# Altium project CSB540otn.PrjPcb (part 1 of 2)
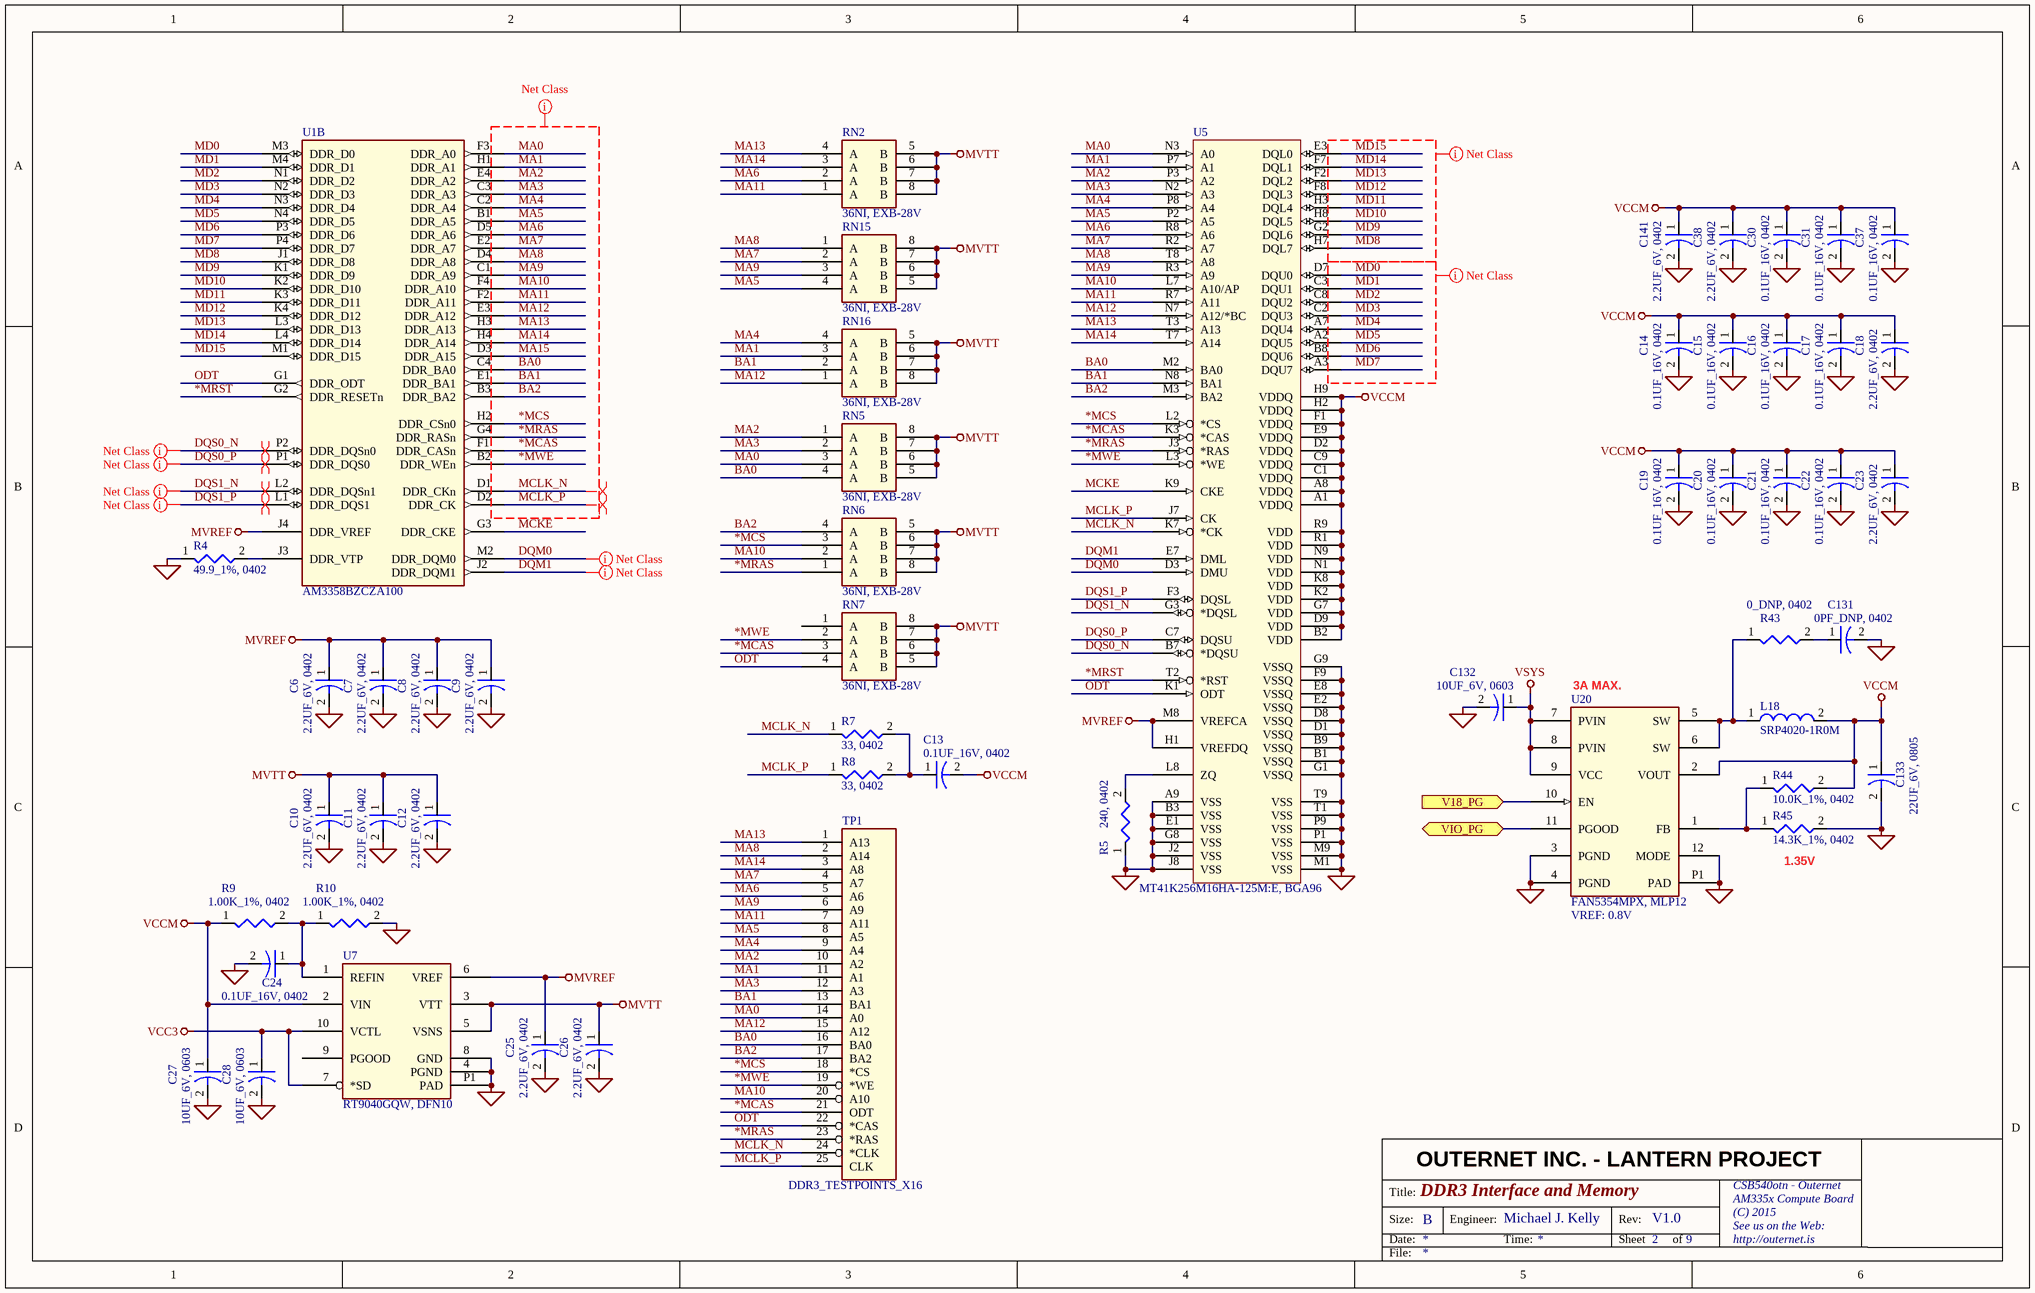
[diagram p0: ddr3_if.SchDoc]
9 sheets, 336 parts. Net scope: flat (ports and power ports of the same name join across sheets).
Board file: CSB540otn.PcbDoc
Sheets:
  rev_notes.SchDoc
  ddr3_if.SchDoc
  cpu_nand.SchDoc
  cpu_io.SchDoc
  enet_phy.SchDoc
  rf_mods.SchDoc
  io_conn.SchDoc
  cpu_pwr.SchDoc
  bat_ctl.SchDoc

## Sheet rev_notes.SchDoc: Revision Notes
size B; Engineer: Michael J. Kelly; Organization: CSB540otn - Outernet; Address1: AM335x Compute Board; Address2: (C) 2015; Address3: See us on the Web:; Address4: http://outernet.is; DocumentNumber: 1; Revision: V1.0; SheetNumber: 1; SheetTotal: 9

### Notes on the sheet
- OUTERNET INC. - LANTERN PROJECT
- Title:
- Size:
- Date:
- B
- Engineer:
- Time:
- Rev:
- Sheet
- of
- File:

## Sheet ddr3_if.SchDoc: DDR3 Interface and Memory
size B; Engineer: Michael J. Kelly; Organization: CSB540otn - Outernet; Address1: AM335x Compute Board; Address2: (C) 2015; Address3: See us on the Web:; Address4: http://outernet.is; DocumentNumber: 2; Revision: V1.0; SheetNumber: 2; SheetTotal: 9

### Parts
C6  2.2UF_6V, 0402  [0402C]
C7  2.2UF_6V, 0402  [0402C]
C8  2.2UF_6V, 0402  [0402C]
C9  2.2UF_6V, 0402  [0402C]
C10  2.2UF_6V, 0402  [0402C]
C11  2.2UF_6V, 0402  [0402C]
C12  2.2UF_6V, 0402  [0402C]
C13  0.1UF_16V, 0402  [0402C]
C14  0.1UF_16V, 0402  [0402C]
C15  0.1UF_16V, 0402  [0402C]
C16  0.1UF_16V, 0402  [0402C]
C17  0.1UF_16V, 0402  [0402C]
C18  2.2UF_6V, 0402  [0402C]
C19  0.1UF_16V, 0402  [0402C]
C20  0.1UF_16V, 0402  [0402C]
C21  0.1UF_16V, 0402  [0402C]
C22  0.1UF_16V, 0402  [0402C]
C23  2.2UF_6V, 0402  [0402C]
C24  0.1UF_16V, 0402  [0402C]
C25  2.2UF_6V, 0402  [0402C]
C26  2.2UF_6V, 0402  [0402C]
C27  10UF_6V, 0603  [0603C]
C28  10UF_6V, 0603  [0603C]
C30  0.1UF_16V, 0402  [0402C]
C31  0.1UF_16V, 0402  [0402C]
C37  0.1UF_16V, 0402  [0402C]
C38  2.2UF_6V, 0402  [0402C]
C131  0PF_DNP, 0402  [0402C]
C132  10UF_6V, 0603  [0603C]
C133  22UF_6V, 0805  [0805C]
C141  2.2UF_6V, 0402  [0402C]
L18  SRP4020-1R0M  [SRP4020]
R4  49.9_1%, 0402  [0402R]
R5  240, 0402  [0402R]
R7  33, 0402  [0402R]
R8  33, 0402  [0402R]
R9  1.00K_1%, 0402  [0402R]
R10  1.00K_1%, 0402  [0402R]
R43  0_DNP, 0402  [0402R]
R44  10.0K_1%, 0402  [0402R]
R45  14.3K_1%, 0402  [0402R]
RN2  36NI, EXB-28V  [EXB-28V]
RN5  36NI, EXB-28V  [EXB-28V]
RN6  36NI, EXB-28V  [EXB-28V]
RN7  36NI, EXB-28V  [EXB-28V]
RN15  36NI, EXB-28V  [EXB-28V]
RN16  36NI, EXB-28V  [EXB-28V]
TP1  DDR3_TESTPOINTS_X16  [DDR2-TP]
U1  AM3358BZCZA100  [BGA324x18]  (part B of 4)
U5  MT41K256M16HA-125M:E, BGA96  [BGA96_DDR3_X16]
U7  RT9040GQW, DFN10  [DFN10]
U20  FAN5354MPX, MLP12  VREF: 0.8V  [mlp12]

### Ports
V18_PG (in), VIO_PG (bidir)

### Nets
GND: C6.2 C7.2 C8.2 C9.2 C10.2 C11.2 C12.2 C14.2 C15.2 C16.2 C17.2 C18.2 C19.2 C20.2 C21.2 C22.2 C23.2 C24.2 C25.2 C26.2 C27.2 C28.2 C30.2 C31.2 C37.2 C38.2 C131.2 C132.2 C133.2 C141.2 R4.1 R5.1 R10.2 R45.2 U5.A9(VSS) U5.B1(VSSQ) U5.B3(VSS) U5.B9(VSSQ) U5.D1(VSSQ) U5.D8(VSSQ) U5.E1(VSS) U5.E2(VSSQ) U5.E8(VSSQ) U5.F9(VSSQ) U5.G1(VSSQ) U5.G8(VSS) U5.G9(VSSQ) U5.J2(VSS) U5.J8(VSS) U5.M1(VSS) U5.M9(VSS) U5.P1(VSS) U5.P9(VSS) U5.T1(VSS) U5.T9(VSS) U7.4(PGND) U7.8(GND) U7.P1(PAD) U20.3(PGND) U20.4(PGND) U20.12(MODE) U20.P1(PAD)
MVREF: C6.1 C7.1 C8.1 C9.1 C25.1 U1.J4(DDR_VREF) U5.H1(VREFDQ) U5.M8(VREFCA) U7.6(VREF)
MVTT: C10.1 C11.1 C12.1 C26.1 RN2.5(B) RN2.6(B) RN2.7(B) RN2.8(B) RN5.5(B) RN5.6(B) RN5.7(B) RN5.8(B) RN6.5(B) RN6.6(B) RN6.7(B) RN6.8(B) RN7.5(B) RN7.6(B) RN7.7(B) RN7.8(B) RN15.5(B) RN15.6(B) RN15.7(B) RN15.8(B) RN16.5(B) RN16.6(B) RN16.7(B) RN16.8(B) U7.3(VTT) U7.5(VSNS)
VCC3: C28.1 U7.7(*SD) U7.10(VCTL)
VCCM: C13.2 C14.1 C15.1 C16.1 C17.1 C18.1 C19.1 C20.1 C21.1 C22.1 C23.1 C27.1 C30.1 C31.1 C37.1 C38.1 C133.1 C141.1 L18.2 R9.1 R44.2 U5.A1(VDDQ) U5.A8(VDDQ) U5.B2(VDD) U5.C1(VDDQ) U5.C9(VDDQ) U5.D2(VDDQ) U5.D9(VDD) U5.E9(VDDQ) U5.F1(VDDQ) U5.G7(VDD) U5.H2(VDDQ) U5.H9(VDDQ) U5.K2(VDD) U5.K8(VDD) U5.N1(VDD) U5.N9(VDD) U5.R1(VDD) U5.R9(VDD) U7.2(VIN) U20.2(VOUT)
VSYS: C132.1 U20.7(PVIN) U20.8(PVIN) U20.9(VCC)
*MCAS: RN7.3(A) TP1.21(ODT) U1.F1(DDR_CASn) U5.K3(*CAS)  [project net *MCAS_2]
*MCS: RN6.3(A) TP1.18(*CS) U1.H2(DDR_CSn0) U5.L2(*CS)  [project net *MCS_2]
*MRAS: RN6.1(A) TP1.23(*RAS) U1.G4(DDR_RASn) U5.J3(*RAS)  [project net *MRAS_2]
*MRST: U1.G2(DDR_RESETn) U5.T2(*RST)  [project net *MRST_2]
*MWE: RN7.2(A) TP1.19(*WE) U1.B2(DDR_WEn) U5.L3(*WE)  [project net *MWE_2]
BA0: RN5.4(A) TP1.16(BA0) U1.C4(DDR_BA0) U5.M2(BA0)  [project net BA0_2]
BA1: RN16.2(A) TP1.13(BA1) U1.E1(DDR_BA1) U5.N8(BA1)  [project net BA1_2]
BA2: RN6.4(A) TP1.17(BA2) U1.B3(DDR_BA2) U5.M3(BA2)  [project net BA2_2]
DQM0: U1.M2(DDR_DQM0) U5.D3(DMU)  [project net DQM0_2]
DQM1: U1.J2(DDR_DQM1) U5.E7(DML)  [project net DQM1_2]
DQS0_N: U1.P2(DDR_DQSn0) U5.B7(*DQSU)  [project net DQS0_N_2]
DQS0_P: U1.P1(DDR_DQS0) U5.C7(DQSU)  [project net DQS0_P_2]
DQS1_N: U1.L2(DDR_DQSn1) U5.G3(*DQSL)  [project net DQS1_N_2]
DQS1_P: U1.L1(DDR_DQS1) U5.F3(DQSL)  [project net DQS1_P_2]
MA0: RN5.3(A) TP1.14(A0) U1.F3(DDR_A0) U5.N3(A0)  [project net MA0_2]
MA1: RN16.3(A) TP1.11(A1) U1.H1(DDR_A1) U5.P7(A1)  [project net MA1_2]
MA2: RN5.1(A) TP1.10(A2) U1.E4(DDR_A2) U5.P3(A2)  [project net MA2_2]
MA3: RN5.2(A) TP1.12(A3) U1.C3(DDR_A3) U5.N2(A3)  [project net MA3_2]
MA4: RN16.4(A) TP1.9(A4) U1.C2(DDR_A4) U5.P8(A4)  [project net MA4_2]
MA5: RN15.4(A) TP1.8(A5) U1.B1(DDR_A5) U5.P2(A5)  [project net MA5_2]
MA6: RN2.2(A) TP1.5(A6) U1.D5(DDR_A6) U5.R8(A6)  [project net MA6_2]
MA7: RN15.2(A) TP1.4(A7) U1.E2(DDR_A7) U5.R2(A7)  [project net MA7_2]
MA8: RN15.1(A) TP1.2(A14) U1.D4(DDR_A8) U5.T8(A8)  [project net MA8_2]
MA9: RN15.3(A) TP1.6(A9) U1.C1(DDR_A9) U5.R3(A9)  [project net MA9_2]
MA10: RN6.2(A) TP1.20(A10) U1.F4(DDR_A10) U5.L7(A10/AP)  [project net MA10_2]
MA11: RN2.1(A) TP1.7(A11) U1.F2(DDR_A11) U5.R7(A11)  [project net MA11_2]
MA12: RN16.1(A) TP1.15(A12) U1.E3(DDR_A12) U5.N7(A12/*BC)  [project net MA12_2]
MA13: RN2.4(A) TP1.1(A13) U1.H3(DDR_A13) U5.T3(A13)  [project net MA13_2]
MA14: RN2.3(A) TP1.3(A8) U1.H4(DDR_A14) U5.T7(A14)  [project net MA14_2]
MA15: U1.D3(DDR_A15)  [project net MA15_2]
MCKE: U1.G3(DDR_CKE) U5.K9(CKE)  [project net MCKE_2]
MCLK_N: R7.1 TP1.24(*CLK) U1.D1(DDR_CKn) U5.K7(*CK)  [project net MCLK_N_2]
MCLK_P: R8.1 TP1.25(CLK) U1.D2(DDR_CK) U5.J7(CK)  [project net MCLK_P_2]
MD0: U1.M3(DDR_D0) U5.D7(DQU0)  [project net MD0_2]
MD1: U1.M4(DDR_D1) U5.C3(DQU1)  [project net MD1_2]
MD2: U1.N1(DDR_D2) U5.C8(DQU2)  [project net MD2_2]
MD3: U1.N2(DDR_D3) U5.C2(DQU3)  [project net MD3_2]
MD4: U1.N3(DDR_D4) U5.A7(DQU4)  [project net MD4_2]
MD5: U1.N4(DDR_D5) U5.A2(DQU5)  [project net MD5_2]
MD6: U1.P3(DDR_D6) U5.B8(DQU6)  [project net MD6_2]
MD7: U1.P4(DDR_D7) U5.A3(DQU7)  [project net MD7_2]
MD8: U1.J1(DDR_D8) U5.H7(DQL7)  [project net MD8_2]
MD9: U1.K1(DDR_D9) U5.G2(DQL6)  [project net MD9_2]
MD10: U1.K2(DDR_D10) U5.H8(DQL5)  [project net MD10_2]
MD11: U1.K3(DDR_D11) U5.H3(DQL4)  [project net MD11_2]
MD12: U1.K4(DDR_D12) U5.F8(DQL3)  [project net MD12_2]
MD13: U1.L3(DDR_D13) U5.F2(DQL2)  [project net MD13_2]
MD14: U1.L4(DDR_D14) U5.F7(DQL1)  [project net MD14_2]
MD15: U1.M1(DDR_D15) U5.E3(DQL0)  [project net MD15_2]
ODT: RN7.4(A) TP1.22(*CAS) U1.G1(DDR_ODT) U5.K1(ODT)  [project net ODT_2]
V18_PG: U20.10(EN) ; port V18_PG
VIO_PG: U20.11(PGOOD) ; port VIO_PG
NetC13_1: C13.1 R7.2 R8.2
NetC24_1: C24.1 R9.2 R10.1 U7.1(REFIN)
NetC131_1: C131.1 R43.2
NetL18_1: L18.1 R43.1 U20.5(SW) U20.6(SW)
NetR4_2: R4.2 U1.J3(DDR_VTP)
NetR5_2: R5.2 U5.L8(ZQ)
NetR44_1: R44.1 R45.1 U20.1(FB)

Not connected (* = marked no-connect by the designer): RN7 1(A); U7 9(PGOOD)

### Layout directives
net class MEM_D0: DQM0_2, DQS0_N_2, DQS0_P_2, MD8, MD9, MD10, MD11, MD12, MD13, MD14, MD15
net class MEM_D1: DQM1_2, DQS1_N_2, DQS1_P_2, MD0, MD1, MD2, MD3, MD4, MD5, MD6, MD7
differential pair: DQS0_N_2, DQS0_P_2, DQS1_N_2, DQS1_P_2, MCLK_N_2, MCLK_P_2
net class MEM_ADD: *MCAS, *MCS, *MRAS, *MWE, BA0, BA1, BA2, MA0, MA1, MA2, MA3, MA4, MA5, MA6, MA7, MA8, MA9, MA10, MA11, MA12, MA13, MA14, MA15, MCLK_N, MCLK_P

### Notes on the sheet
- (near U20) 3A MAX.
- (near R45) 1.35V
- OUTERNET INC. - LANTERN PROJECT
- Title:
- Size:
- Date:
- B
- Engineer:
- Time:
- Rev:
- Sheet
- of
- File:

### Library data of the parts
C6-C12 C18 C23 C25 C26 C38 C141 = 2.2UF_6V, 0402: CAP - 0402 PKG
C13-C17 C19-C22 C24 C30 C31 C37 = 0.1UF_16V, 0402: CAP - 0402 PKG
C27 C28 C132 = 10UF_6V, 0603: CAP - 0603 PKG
C131 = 0PF_DNP, 0402: CAP - 0402 PKG
C133 = 22UF_6V, 0805: CAP - 0805 PKG
L18 = SRP4020-1R0M: INDUCTOR - 1.0UH, 5/6A, 4MM x 4MM x 2MM, 22mohm
R4 = 49.9_1%, 0402: RES - 0402 PKG
R5 = 240, 0402: RES - 0402 PKG
R7 R8 = 33, 0402: RES - 0402 PKG
R9 R10 = 1.00K_1%, 0402: RES - 0402 PKG
R43 = 0_DNP, 0402: RES - 0402 PKG, DO NOT POPULATE BY DEFAULT
R44 = 10.0K_1%, 0402: RES - 0402 PKG
R45 = 14.3K_1%, 0402: RES - 0402 PKG
RN2 RN5-RN7 RN15 RN16 = 36NI, EXB-28V: RES NET, 4 INDIVIDUAL, EXB-28V
TP1 = DDR3_TESTPOINTS_X16: MISC - DDR3 ROUTING PATTERN, 16-BIT
U1 = AM3358BZCZA100: MPU - CORTEX-A8 CORE, SDIO, GIGe, USB x2, UART x3, CAN, 2D/3D
U5 = MT41K256M16HA-125M:E, BGA96: SDRAM - 4GBIT, DDR3/L-1600, x16
U7 = RT9040GQW, DFN10: LDO - DDR2/3 VREF AND VTT, 3A
U20 = FAN5354MPX, MLP12: SWITCHER - 270ua Iq, 3A, 2.7V TO 5.5V IN, 0.8V TO VIN OUT

## Sheet cpu_nand.SchDoc: CPU I/O and NAND
size B; Engineer: Michael J. Kelly; Organization: CSB540otn - Outernet; Address1: AM335x Compute Board; Address2: (C) 2015; Address3: See us on the Web:; Address4: http://outernet.is; DocumentNumber: 3; Revision: V1.0; SheetNumber: 3; SheetTotal: 9
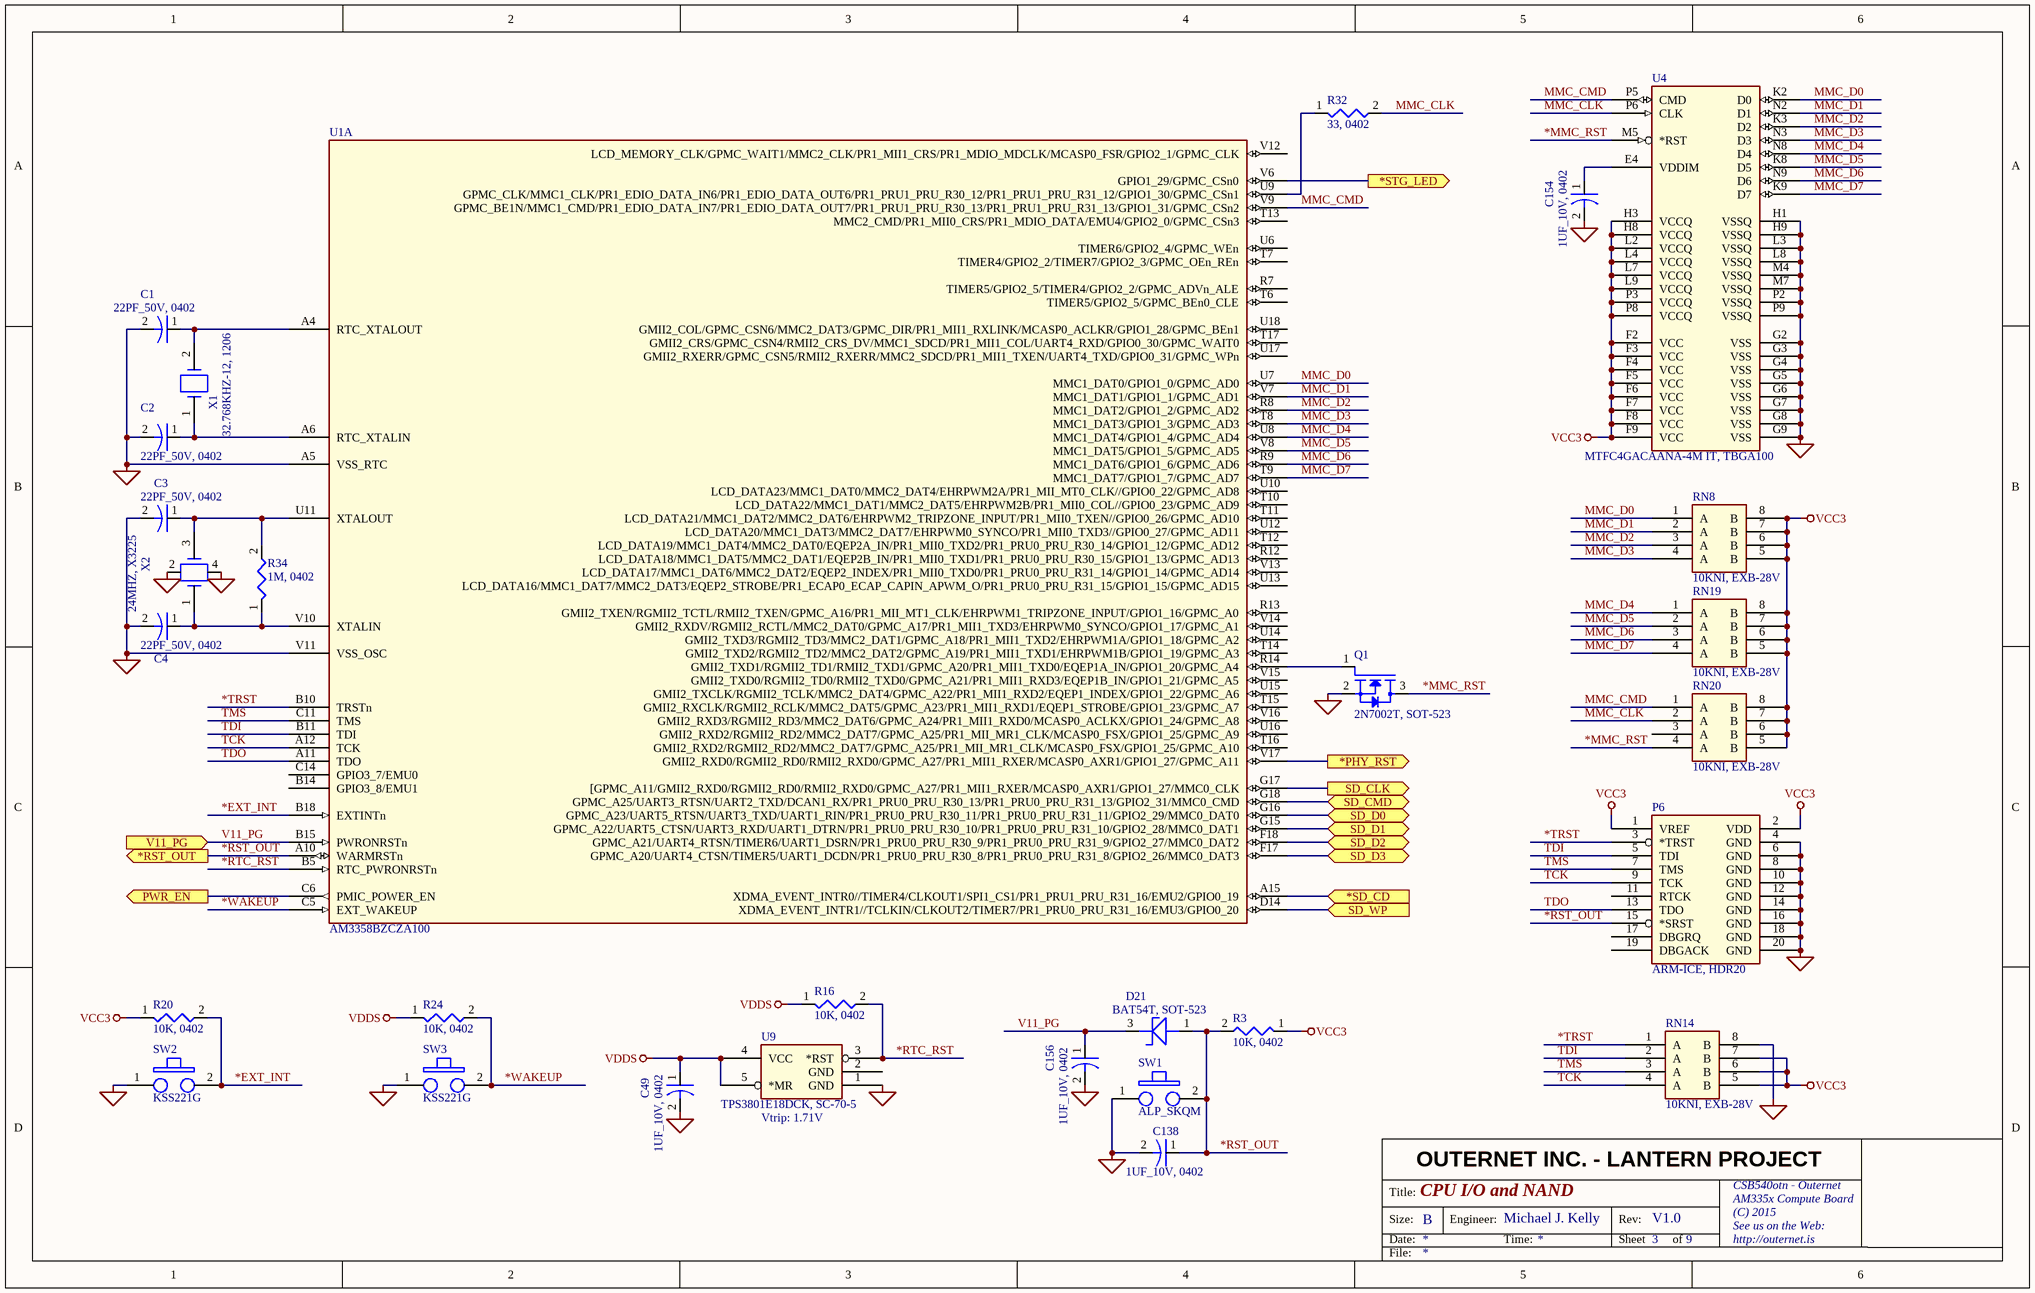
[diagram p1: cpu_nand.SchDoc]

### Parts
C1  22PF_50V, 0402  [0402C]
C2  22PF_50V, 0402  [0402C]
C3  22PF_50V, 0402  [0402C]
C4  22PF_50V, 0402  [0402C]
C49  1UF_10V, 0402  [0402C]
C138  1UF_10V, 0402  [0402C]
C154  1UF_10V, 0402  [0402C]
C156  1UF_10V, 0402  [0402C]
D21  BAT54T, SOT-523  [SOT-523]
P6  ARM-ICE, HDR20  [HDR20]
Q1  2N7002T, SOT-523  [SOT-523]
R3  10K, 0402  [0402R]
R16  10K, 0402  [0402R]
R20  10K, 0402  [0402R]
R24  10K, 0402  [0402R]
R32  33, 0402  [0402R]
R34  1M, 0402  [0402R]
RN8  10KNI, EXB-28V  [EXB-28V]
RN14  10KNI, EXB-28V  [EXB-28V]
RN19  10KNI, EXB-28V  [EXB-28V]
RN20  10KNI, EXB-28V  [EXB-28V]
SW1  ALP_SKQM  [ALPS_SKQM]
SW2  KSS221G  [KSS221G]
SW3  KSS221G  [KSS221G]
U1  AM3358BZCZA100  [BGA324x18]  (part A of 4)
U4  MTFC4GACAANA-4M IT, TBGA100  [TBGA100]
U9  TPS3801E18DCK, SC-70-5  Vtrip: 1.71V  [SOT-353/SC-70-5]
X1  32.768KHZ-12, 1206  [1206X]
X2  24MHZ, X3225  [X3225]

### Ports
*PHY_RST (out), *RST_OUT (out), *SD_CD (in), *STG_LED (out), PWR_EN (out), SD_CLK (out), SD_CMD (bidir), SD_D0 (bidir), SD_D1 (bidir), SD_D2 (bidir), SD_D3 (bidir), SD_WP (in), V11_PG (in)

### Nets
GND: C1.2 C2.2 C3.2 C4.2 C49.2 C138.2 C154.2 C156.2 P6.4(GND) P6.6(GND) P6.8(GND) P6.10(GND) P6.12(GND) P6.14(GND) P6.16(GND) P6.18(GND) P6.20(GND) Q1.2(SOURCE) RN14.8(B) SW1.1 SW2.1 SW3.1 U1.A5(VSS_RTC) U1.V11(VSS_OSC) U4.G2(VSS) U4.G3(VSS) U4.G4(VSS) U4.G5(VSS) U4.G6(VSS) U4.G7(VSS) U4.G8(VSS) U4.G9(VSS) U4.H1(VSSQ) U4.H9(VSSQ) U4.L3(VSSQ) U4.L8(VSSQ) U4.M4(VSSQ) U4.M7(VSSQ) U4.P2(VSSQ) U4.P9(VSSQ) U9.1(GND) X2.2 X2.4
VCC3: P6.1(VREF) P6.2(VDD) R3.1 R20.1 RN8.5(B) RN8.6(B) RN8.7(B) RN8.8(B) RN14.5(B) RN14.6(B) RN14.7(B) RN19.5(B) RN19.6(B) RN19.7(B) RN19.8(B) RN20.5(B) RN20.6(B) RN20.7(B) RN20.8(B) U4.F2(VCC) U4.F3(VCC) U4.F4(VCC) U4.F5(VCC) U4.F6(VCC) U4.F7(VCC) U4.F8(VCC) U4.F9(VCC) U4.H3(VCCQ) U4.H8(VCCQ) U4.L2(VCCQ) U4.L4(VCCQ) U4.L7(VCCQ) U4.L9(VCCQ) U4.P3(VCCQ) U4.P8(VCCQ)
VDDS: C49.1 R16.1 R24.1 U9.4(VCC) U9.5(*MR)
*EXT_INT: R20.2 SW2.2 U1.B18(EXTINTn)  [project net *EXT_INT_3]
*MMC_RST: Q1.3(DRAIN) RN20.4(A) U4.M5(*RST)  [project net *MMC_RST_3]
*PHY_RST: U1.V17(GMII2_RXD0/RGMII2_RD0/RMII2_RXD0/GPMC_A27/PR1_MII1_RXER/MCASP0_AXR1/GPIO1_27/GPMC_A11) ; port *PHY_RST
*RST_OUT: C138.1 D21.1(ANODE) P6.15(*SRST) R3.2 SW1.2 U1.A10(WARMRSTn) ; port *RST_OUT
*RTC_RST: R16.2 U1.B5(RTC_PWRONRSTn) U9.3(*RST)  [project net *RTC_RST_3]
*SD_CD: U1.A15(XDMA_EVENT_INTR0//TIMER4/CLKOUT1/SPI1_CS1/PR1_PRU1_PRU_R31_16/EMU2/GPIO0_19) ; port *SD_CD
*STG_LED: U1.V6(GPIO1_29/GPMC_CSn0) ; port *STG_LED
*TRST: P6.3(*TRST) RN14.1(A) U1.B10(TRSTn)  [project net *TRST_3]
*WAKEUP: R24.2 SW3.2 U1.C5(EXT_WAKEUP)  [project net *WAKEUP_3]
MMC_CLK: R32.2 RN20.2(A) U4.P6(CLK)  [project net MMC_CLK_3]
MMC_CMD: RN20.1(A) U1.V9(GPMC_BE1N/MMC1_CMD/PR1_EDIO_DATA_IN7/PR1_EDIO_DATA_OUT7/PR1_PRU1_PRU_R30_13/PR1_PRU1_PRU_R31_13/GPIO1_31/GPMC_CSn2) U4.P5(CMD)  [project net MMC_CMD_3]
MMC_D0: RN8.1(A) U1.U7(MMC1_DAT0/GPIO1_0/GPMC_AD0) U4.K2(D0)  [project net MMC_D0_3]
MMC_D1: RN8.2(A) U1.V7(MMC1_DAT1/GPIO1_1/GPMC_AD1) U4.N2(D1)  [project net MMC_D1_3]
MMC_D2: RN8.3(A) U1.R8(MMC1_DAT2/GPIO1_2/GPMC_AD2) U4.K3(D2)  [project net MMC_D2_3]
MMC_D3: RN8.4(A) U1.T8(MMC1_DAT3/GPIO1_3/GPMC_AD3) U4.N3(D3)  [project net MMC_D3_3]
MMC_D4: RN19.1(A) U1.U8(MMC1_DAT4/GPIO1_4/GPMC_AD4) U4.N8(D4)  [project net MMC_D4_3]
MMC_D5: RN19.2(A) U1.V8(MMC1_DAT5/GPIO1_5/GPMC_AD5) U4.K8(D5)  [project net MMC_D5_3]
MMC_D6: RN19.3(A) U1.R9(MMC1_DAT6/GPIO1_6/GPMC_AD6) U4.N9(D6)  [project net MMC_D6_3]
MMC_D7: RN19.4(A) U1.T9(MMC1_DAT7/GPIO1_7/GPMC_AD7) U4.K9(D7)  [project net MMC_D7_3]
PWR_EN: U1.C6(PMIC_POWER_EN) ; port PWR_EN
SD_CLK: U1.G17([GPMC_A11/GMII2_RXD0/RGMII2_RD0/RMII2_RXD0/GPMC_A27/PR1_MII1_RXER/MCASP0_AXR1/GPIO1_27/MMC0_CLK) ; port SD_CLK
SD_CMD: U1.G18(GPMC_A25/UART3_RTSN/UART2_TXD/DCAN1_RX/PR1_PRU0_PRU_R30_13/PR1_PRU0_PRU_R31_13/GPIO2_31/MMC0_CMD) ; port SD_CMD
SD_D0: U1.G16(GPMC_A23/UART5_RTSN/UART3_TXD/UART1_RIN/PR1_PRU0_PRU_R30_11/PR1_PRU0_PRU_R31_11/GPIO2_29/MMC0_DAT0) ; port SD_D0
SD_D1: U1.G15(GPMC_A22/UART5_CTSN/UART3_RXD/UART1_DTRN/PR1_PRU0_PRU_R30_10/PR1_PRU0_PRU_R31_10/GPIO2_28/MMC0_DAT1) ; port SD_D1
SD_D2: U1.F18(GPMC_A21/UART4_RTSN/TIMER6/UART1_DSRN/PR1_PRU0_PRU_R30_9/PR1_PRU0_PRU_R31_9/GPIO2_27/MMC0_DAT2) ; port SD_D2
SD_D3: U1.F17(GPMC_A20/UART4_CTSN/TIMER5/UART1_DCDN/PR1_PRU0_PRU_R30_8/PR1_PRU0_PRU_R31_8/GPIO2_26/MMC0_DAT3) ; port SD_D3
SD_WP: U1.D14(XDMA_EVENT_INTR1//TCLKIN/CLKOUT2/TIMER7/PR1_PRU0_PRU_R31_16/EMU3/GPIO0_20) ; port SD_WP
TCK: P6.9(TCK) RN14.4(A) U1.A12(TCK)  [project net TCK_3]
TDI: P6.5(TDI) RN14.2(A) U1.B11(TDI)  [project net TDI_3]
TDO: P6.13(TDO) U1.A11(TDO)  [project net TDO_3]
TMS: P6.7(TMS) RN14.3(A) U1.C11(TMS)  [project net TMS_3]
V11_PG: C156.1 D21.3(CATHODE) U1.B15(PWRONRSTn) ; port V11_PG
NetC1_1: C1.1 U1.A4(RTC_XTALOUT) X1.2
NetC2_1: C2.1 U1.A6(RTC_XTALIN) X1.1
NetC3_1: C3.1 R34.2 U1.U11(XTALOUT) X2.3
NetC4_1: C4.1 R34.1 U1.V10(XTALIN) X2.1
NetC154_1: C154.1 U4.E4(VDDIM)
NetQ1_1: Q1.1(GATE) U1.R14(GMII2_TXD1/RGMII2_TD1/RMII2_TXD1/GPMC_A20/PR1_MII1_TXD0/EQEP1A_IN/GPIO1_20/GPMC_A4)
NetR32_1: R32.1 U1.U9(GPMC_CLK/MMC1_CLK/PR1_EDIO_DATA_IN6/PR1_EDIO_DATA_OUT6/PR1_PRU1_PRU_R30_12/PR1_PRU1_PRU_R31_12/GPIO1_30/GPMC_CSn1)

Not connected (* = marked no-connect by the designer): P6 11(RTCK) 17(DBGRQ) 19(DBGACK); RN20 3(A); U1 B14(GPIO3_8/EMU1) C14(GPIO3_7/EMU0) R7(TIMER5/GPIO2_5/TIMER4/GPIO2_2/GPMC_ADVn_ALE) R12(LCD_DATA18/MMC1_DAT5/MMC2_DAT1/EQEP2B_IN/PR1_MII0_TXD1/PR1_PRU0_PRU_R30_15/GPIO1_13/GPMC_AD13) R13(GMII2_TXEN/RGMII2_TCTL/RMII2_TXEN/GPMC_A16/PR1_MII_MT1_CLK/EHRPWM1_TRIPZONE_INPUT/GPIO1_16/GPMC_A0) T6(TIMER5/GPIO2_5/GPMC_BEn0_CLE) T7(TIMER4/GPIO2_2/TIMER7/GPIO2_3/GPMC_OEn_REn) T10(LCD_DATA22/MMC1_DAT1/MMC2_DAT5/EHRPWM2B/PR1_MII0_COL//GPIO0_23/GPMC_AD9) T11(LCD_DATA21/MMC1_DAT2/MMC2_DAT6/EHRPWM2_TRIPZONE_INPUT/PR1_MII0_TXEN//GPIO0_26/GPMC_AD10) T12(LCD_DATA19/MMC1_DAT4/MMC2_DAT0/EQEP2A_IN/PR1_MII0_TXD2/PR1_PRU0_PRU_R30_14/GPIO1_12/GPMC_AD12) T13(MMC2_CMD/PR1_MII0_CRS/PR1_MDIO_DATA/EMU4/GPIO2_0/GPMC_CSn3) T14(GMII2_TXD2/RGMII2_TD2/MMC2_DAT2/GPMC_A19/PR1_MII1_TXD1/EHRPWM1B/GPIO1_19/GPMC_A3) T15(GMII2_RXCLK/RGMII2_RCLK/MMC2_DAT5/GPMC_A23/PR1_MII1_RXD1/EQEP1_STROBE/GPIO1_23/GPMC_A7) T16(GMII2_RXD2/RGMII2_RD2/MMC2_DAT7/GPMC_A25/PR1_MII_MR1_CLK/MCASP0_FSX/GPIO1_25/GPMC_A10) T17(GMII2_CRS/GPMC_CSN4/RMII2_CRS_DV/MMC1_SDCD/PR1_MII1_COL/UART4_RXD/GPIO0_30/GPMC_WAIT0) U6(TIMER6/GPIO2_4/GPMC_WEn) U10(LCD_DATA23/MMC1_DAT0/MMC2_DAT4/EHRPWM2A/PR1_MII_MT0_CLK//GPIO0_22/GPMC_AD8) U12(LCD_DATA20/MMC1_DAT3/MMC2_DAT7/EHRPWM0_SYNCO/PR1_MII0_TXD3//GPIO0_27/GPMC_AD11) U13(LCD_DATA16/MMC1_DAT7/MMC2_DAT3/EQEP2_STROBE/PR1_ECAP0_ECAP_CAPIN_APWM_O/PR1_PRU0_PRU_R31_15/GPIO1_15/GPMC_AD15) U14(GMII2_TXD3/RGMII2_TD3/MMC2_DAT1/GPMC_A18/PR1_MII1_TXD2/EHRPWM1A/GPIO1_18/GPMC_A2) U15(GMII2_TXCLK/RGMII2_TCLK/MMC2_DAT4/GPMC_A22/PR1_MII1_RXD2/EQEP1_INDEX/GPIO1_22/GPMC_A6) U16(GMII2_RXD2/RGMII2_RD2/MMC2_DAT7/GPMC_A25/PR1_MII_MR1_CLK/MCASP0_FSX/GPIO1_25/GPMC_A9) U17(GMII2_RXERR/GPMC_CSN5/RMII2_RXERR/MMC2_SDCD/PR1_MII1_TXEN/UART4_TXD/GPIO0_31/GPMC_WPn) U18(GMII2_COL/GPMC_CSN6/MMC2_DAT3/GPMC_DIR/PR1_MII1_RXLINK/MCASP0_ACLKR/GPIO1_28/GPMC_BEn1) V12(LCD_MEMORY_CLK/GPMC_WAIT1/MMC2_CLK/PR1_MII1_CRS/PR1_MDIO_MDCLK/MCASP0_FSR/GPIO2_1/GPMC_CLK) V13(LCD_DATA17/MMC1_DAT6/MMC2_DAT2/EQEP2_INDEX/PR1_MII0_TXD0/PR1_PRU0_PRU_R31_14/GPIO1_14/GPMC_AD14) V14(GMII2_RXDV/RGMII2_RCTL/MMC2_DAT0/GPMC_A17/PR1_MII1_TXD3/EHRPWM0_SYNCO/GPIO1_17/GPMC_A1) V15(GMII2_TXD0/RGMII2_TD0/RMII2_TXD0/GPMC_A21/PR1_MII1_RXD3/EQEP1B_IN/GPIO1_21/GPMC_A5) V16(GMII2_RXD3/RGMII2_RD3/MMC2_DAT6/GPMC_A24/PR1_MII1_RXD0/MCASP0_ACLKX/GPIO1_24/GPMC_A8); U9 2(GND)

### Notes on the sheet
- OUTERNET INC. - LANTERN PROJECT
- Title:
- Size:
- Date:
- B
- Engineer:
- Time:
- Rev:
- Sheet
- of
- File:

### Library data of the parts
C1-C4 = 22PF_50V, 0402: CAP - 0402 PKG
C49 C138 C154 C156 = 1UF_10V, 0402: CAP - 0402 PKG
D21 = BAT54T, SOT-523: DIODE - SCHOTTKY, 30V, 200MA
P6 = ARM-ICE, HDR20: CONN - ARM JTAG CONNECTOR
Q1 = 2N7002T, SOT-523: N-FET - 60V, 500ma @ 10V, Vgs(th) 2V
R3 R16 R20 R24 = 10K, 0402: RES - 0402 PKG
R32 = 33, 0402: RES - 0402 PKG
R34 = 1M, 0402: RES - 0402 PKG
RN8 RN14 RN19 RN20 = 10KNI, EXB-28V: RES NET, 4 INDIVIDUAL, EXB-28V
SW1 = ALP_SKQM: SWITCH - PUSHBUTTON SMT, 6MM X 3.5MM
SW2 SW3 = KSS221G: SWITCH - PUSHBUTTON SMT, SIDE ACTUATED
U1 = AM3358BZCZA100: as U1 on sheet ddr3_if
U4 = MTFC4GACAANA-4M IT, TBGA100: NAND FLASH - eMMC 4GB/8GB
U9 = TPS3801E18DCK, SC-70-5: IC - RESET, 1.71V, 200MSEC, MR INPUT, OPEN DRAIN OUTPUT
X1 = 32.768KHZ-12, 1206: CRYSTAL - SMT, 1206, 12.5PF, ABS07 PKG
X2 = 24MHZ, X3225: CRYSTAL - SMT, 3.2MM x 2.5MM, ABM8 PKG

## Sheet cpu_io.SchDoc: CPU I/O and Configuration
size B; Engineer: Michael J. Kelly; Organization: CSB540otn - Outernet; Address1: AM335x Compute Board; Address2: (C) 2015; Address3: See us on the Web:; Address4: http://outernet.is; DocumentNumber: 4; Revision: V1.0; SheetNumber: 4; SheetTotal: 9
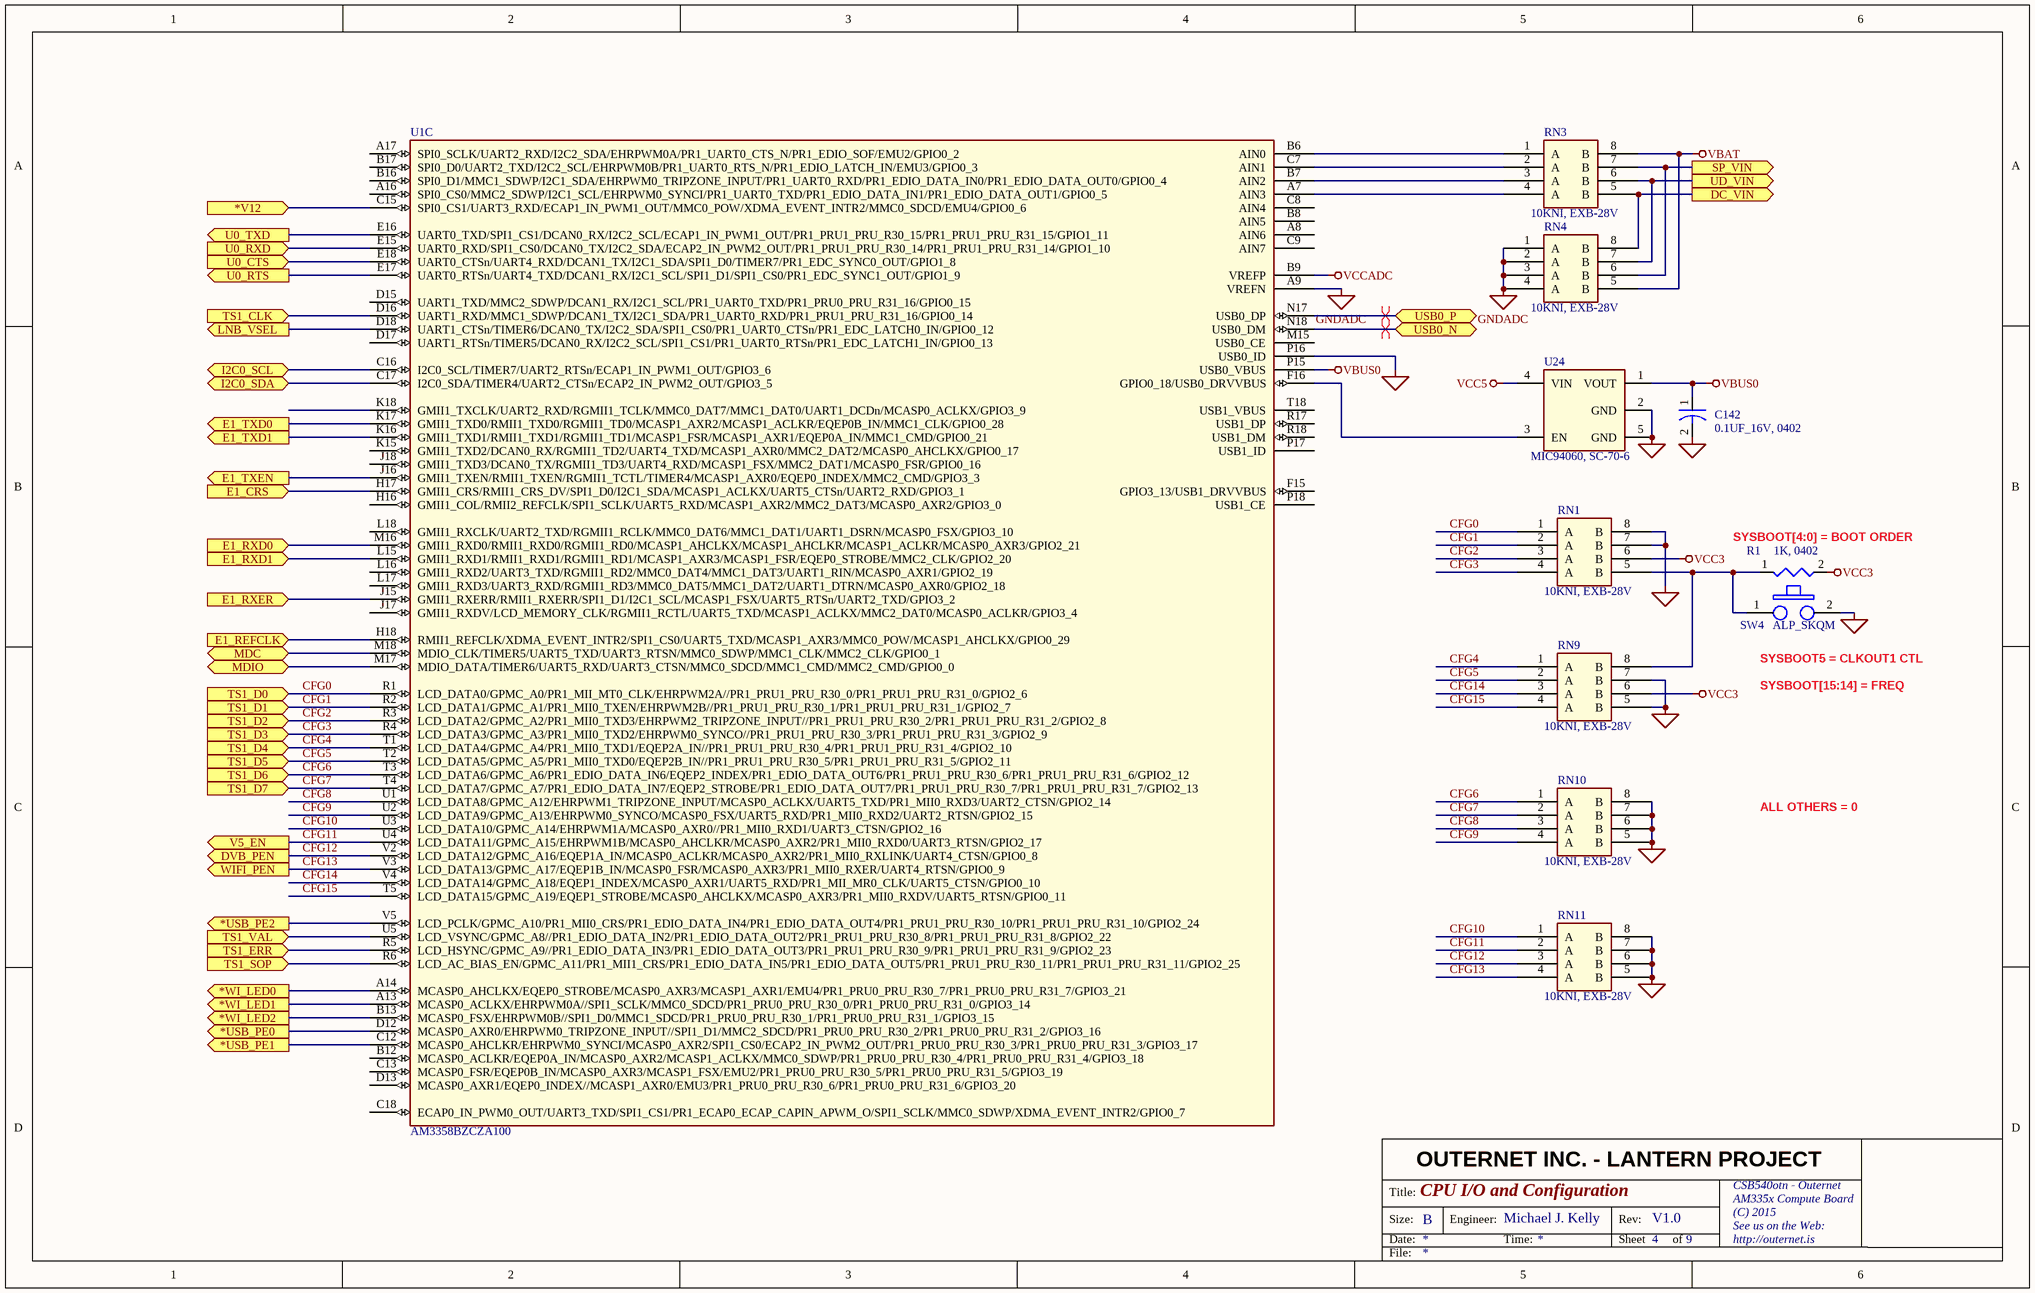
[diagram p2: cpu_io.SchDoc]

### Parts
(Parts that share a designator on the sheet are numbered #1, #2 ... from top to bottom, then left to right.)
C142  0.1UF_16V, 0402  [0402C]
R1  1K, 0402  [0402R]
RN1  10KNI, EXB-28V  [EXB-28V]
RN3  10KNI, EXB-28V  [EXB-28V]
RN4  10KNI, EXB-28V  [EXB-28V]
RN9  10KNI, EXB-28V  [EXB-28V]
RN10  10KNI, EXB-28V  [EXB-28V]
RN11  10KNI, EXB-28V  [EXB-28V]
SW4  ALP_SKQM  [ALPS_SKQM]
U1  AM3358BZCZA100  [BGA324x18]  (part C of 4)
U24#1  MIC94060, SC-70-6  [SOT-363/SC-70-6]

### Ports
*USB_PE0 (out), *USB_PE1 (out), *USB_PE2 (out), *V12 (in), *WI_LED0 (out), *WI_LED1 (out), *WI_LED2 (out), DC_VIN (out), DVB_PEN (out), E1_CRS (in), E1_REFCLK (in), E1_RXD0 (in), E1_RXD1 (in), E1_RXER (in), E1_TXD0 (out), E1_TXD1 (out), E1_TXEN (out), I2C0_SCL (bidir), I2C0_SDA (bidir), LNB_VSEL (out), MDC (bidir), MDIO (bidir), SP_VIN (out), TS1_CLK (in), TS1_D0 (in), TS1_D1 (in), TS1_D2 (in), TS1_D3 (in), TS1_D4 (in), TS1_D5 (in), TS1_D6 (in), TS1_D7 (in), TS1_ERR (in), TS1_SOP (in), TS1_VAL (in), U0_CTS (in), U0_RTS (out), U0_RXD (in), U0_TXD (out), UD_VIN (out), USB0_N (bidir), USB0_P (bidir), V5_EN (out), WIFI_PEN (out)

### Nets
GND: C142.2 RN1.7(B) RN1.8(B) RN9.5(B) RN9.7(B) RN10.5(B) RN10.6(B) RN10.7(B) RN10.8(B) RN11.5(B) RN11.6(B) RN11.7(B) RN11.8(B) SW4.2 U1.P16(USB0_ID) U24#1.2(GND) U24#1.5(GND)
GNDADC: RN4.1(A) RN4.2(A) RN4.3(A) RN4.4(A) U1.A9(VREFN)
VBAT: RN3.8(B) RN4.5(B)
VBUS0: C142.1 U1.P15(USB0_VBUS) U24#1.1(VOUT)
VCC3: R1.2 RN1.6(B) RN9.6(B)
VCC5: U24#1.4(VIN)
VCCADC: U1.B9(VREFP)
*USB_PE0: U1.D12(MCASP0_AXR0/EHRPWM0_TRIPZONE_INPUT//SPI1_D1/MMC2_SDCD/PR1_PRU0_PRU_R30_2/PR1_PRU0_PRU_R31_2/GPIO3_16) ; port *USB_PE0
*USB_PE1: U1.C12(MCASP0_AHCLKR/EHRPWM0_SYNCI/MCASP0_AXR2/SPI1_CS0/ECAP2_IN_PWM2_OUT/PR1_PRU0_PRU_R30_3/PR1_PRU0_PRU_R31_3/GPIO3_17) ; port *USB_PE1
*USB_PE2: U1.V5(LCD_PCLK/GPMC_A10/PR1_MII0_CRS/PR1_EDIO_DATA_IN4/PR1_EDIO_DATA_OUT4/PR1_PRU1_PRU_R30_10/PR1_PRU1_PRU_R31_10/GPIO2_24) ; port *USB_PE2
*V12: U1.C15(SPI0_CS1/UART3_RXD/ECAP1_IN_PWM1_OUT/MMC0_POW/XDMA_EVENT_INTR2/MMC0_SDCD/EMU4/GPIO0_6) ; port *V12
*WI_LED0: U1.A14(MCASP0_AHCLKX/EQEP0_STROBE/MCASP0_AXR3/MCASP1_AXR1/EMU4/PR1_PRU0_PRU_R30_7/PR1_PRU0_PRU_R31_7/GPIO3_21) ; port *WI_LED0
*WI_LED1: U1.A13(MCASP0_ACLKX/EHRPWM0A//SPI1_SCLK/MMC0_SDCD/PR1_PRU0_PRU_R30_0/PR1_PRU0_PRU_R31_0/GPIO3_14) ; port *WI_LED1
*WI_LED2: U1.B13(MCASP0_FSX/EHRPWM0B//SPI1_D0/MMC1_SDCD/PR1_PRU0_PRU_R30_1/PR1_PRU0_PRU_R31_1/GPIO3_15) ; port *WI_LED2
CFG0: RN1.1(A) U1.R1(LCD_DATA0/GPMC_A0/PR1_MII_MT0_CLK/EHRPWM2A//PR1_PRU1_PRU_R30_0/PR1_PRU1_PRU_R31_0/GPIO2_6) ; port TS1_D0
CFG1: RN1.2(A) U1.R2(LCD_DATA1/GPMC_A1/PR1_MII0_TXEN/EHRPWM2B//PR1_PRU1_PRU_R30_1/PR1_PRU1_PRU_R31_1/GPIO2_7) ; port TS1_D1
CFG2: RN1.3(A) U1.R3(LCD_DATA2/GPMC_A2/PR1_MII0_TXD3/EHRPWM2_TRIPZONE_INPUT//PR1_PRU1_PRU_R30_2/PR1_PRU1_PRU_R31_2/GPIO2_8) ; port TS1_D2
CFG3: RN1.4(A) U1.R4(LCD_DATA3/GPMC_A3/PR1_MII0_TXD2/EHRPWM0_SYNCO//PR1_PRU1_PRU_R30_3/PR1_PRU1_PRU_R31_3/GPIO2_9) ; port TS1_D3
CFG4: RN9.1(A) U1.T1(LCD_DATA4/GPMC_A4/PR1_MII0_TXD1/EQEP2A_IN//PR1_PRU1_PRU_R30_4/PR1_PRU1_PRU_R31_4/GPIO2_10) ; port TS1_D4
CFG5: RN9.2(A) U1.T2(LCD_DATA5/GPMC_A5/PR1_MII0_TXD0/EQEP2B_IN//PR1_PRU1_PRU_R30_5/PR1_PRU1_PRU_R31_5/GPIO2_11) ; port TS1_D5
CFG6: RN10.1(A) U1.T3(LCD_DATA6/GPMC_A6/PR1_EDIO_DATA_IN6/EQEP2_INDEX/PR1_EDIO_DATA_OUT6/PR1_PRU1_PRU_R30_6/PR1_PRU1_PRU_R31_6/GPIO2_12) ; port TS1_D6
CFG7: RN10.2(A) U1.T4(LCD_DATA7/GPMC_A7/PR1_EDIO_DATA_IN7/EQEP2_STROBE/PR1_EDIO_DATA_OUT7/PR1_PRU1_PRU_R30_7/PR1_PRU1_PRU_R31_7/GPIO2_13) ; port TS1_D7
CFG8: RN10.3(A) U1.U1(LCD_DATA8/GPMC_A12/EHRPWM1_TRIPZONE_INPUT/MCASP0_ACLKX/UART5_TXD/PR1_MII0_RXD3/UART2_CTSN/GPIO2_14)  [project net CFG8_4]
CFG9: RN10.4(A) U1.U2(LCD_DATA9/GPMC_A13/EHRPWM0_SYNCO/MCASP0_FSX/UART5_RXD/PR1_MII0_RXD2/UART2_RTSN/GPIO2_15)  [project net CFG9_4]
CFG10: RN11.1(A) U1.U3(LCD_DATA10/GPMC_A14/EHRPWM1A/MCASP0_AXR0//PR1_MII0_RXD1/UART3_CTSN/GPIO2_16)  [project net CFG10_4]
CFG11: RN11.2(A) U1.U4(LCD_DATA11/GPMC_A15/EHRPWM1B/MCASP0_AHCLKR/MCASP0_AXR2/PR1_MII0_RXD0/UART3_RTSN/GPIO2_17) ; port V5_EN
CFG12: RN11.3(A) U1.V2(LCD_DATA12/GPMC_A16/EQEP1A_IN/MCASP0_ACLKR/MCASP0_AXR2/PR1_MII0_RXLINK/UART4_CTSN/GPIO0_8) ; port DVB_PEN
CFG13: RN11.4(A) U1.V3(LCD_DATA13/GPMC_A17/EQEP1B_IN/MCASP0_FSR/MCASP0_AXR3/PR1_MII0_RXER/UART4_RTSN/GPIO0_9) ; port WIFI_PEN
CFG14: RN9.3(A) U1.V4(LCD_DATA14/GPMC_A18/EQEP1_INDEX/MCASP0_AXR1/UART5_RXD/PR1_MII_MR0_CLK/UART5_CTSN/GPIO0_10)  [project net CFG14_4]
CFG15: RN9.4(A) U1.T5(LCD_DATA15/GPMC_A19/EQEP1_STROBE/MCASP0_AHCLKX/MCASP0_AXR3/PR1_MII0_RXDV/UART5_RTSN/GPIO0_11)  [project net CFG15_4]
DC_VIN: RN3.5(B) RN4.8(B) ; port DC_VIN
E1_CRS: U1.H17(GMII1_CRS/RMII1_CRS_DV/SPI1_D0/I2C1_SDA/MCASP1_ACLKX/UART5_CTSn/UART2_RXD/GPIO3_1) ; port E1_CRS
E1_REFCLK: U1.H18(RMII1_REFCLK/XDMA_EVENT_INTR2/SPI1_CS0/UART5_TXD/MCASP1_AXR3/MMC0_POW/MCASP1_AHCLKX/GPIO0_29) ; port E1_REFCLK
E1_RXD0: U1.M16(GMII1_RXD0/RMII1_RXD0/RGMII1_RD0/MCASP1_AHCLKX/MCASP1_AHCLKR/MCASP1_ACLKR/MCASP0_AXR3/GPIO2_21) ; port E1_RXD0
E1_RXD1: U1.L15(GMII1_RXD1/RMII1_RXD1/RGMII1_RD1/MCASP1_AXR3/MCASP1_FSR/EQEP0_STROBE/MMC2_CLK/GPIO2_20) ; port E1_RXD1
E1_RXER: U1.J15(GMII1_RXERR/RMII1_RXERR/SPI1_D1/I2C1_SCL/MCASP1_FSX/UART5_RTSn/UART2_TXD/GPIO3_2) ; port E1_RXER
E1_TXD0: U1.K17(GMII1_TXD0/RMII1_TXD0/RGMII1_TD0/MCASP1_AXR2/MCASP1_ACLKR/EQEP0B_IN/MMC1_CLK/GPIO0_28) ; port E1_TXD0
E1_TXD1: U1.K16(GMII1_TXD1/RMII1_TXD1/RGMII1_TD1/MCASP1_FSR/MCASP1_AXR1/EQEP0A_IN/MMC1_CMD/GPIO0_21) ; port E1_TXD1
E1_TXEN: U1.J16(GMII1_TXEN/RMII1_TXEN/RGMII1_TCTL/TIMER4/MCASP1_AXR0/EQEP0_INDEX/MMC2_CMD/GPIO3_3) ; port E1_TXEN
I2C0_SCL: U1.C16(I2C0_SCL/TIMER7/UART2_RTSn/ECAP1_IN_PWM1_OUT/GPIO3_6) ; port I2C0_SCL
I2C0_SDA: U1.C17(I2C0_SDA/TIMER4/UART2_CTSn/ECAP2_IN_PWM2_OUT/GPIO3_5) ; port I2C0_SDA
LNB_VSEL: U1.D18(UART1_CTSn/TIMER6/DCAN0_TX/I2C2_SDA/SPI1_CS0/PR1_UART0_CTSn/PR1_EDC_LATCH0_IN/GPIO0_12) ; port LNB_VSEL
MDC: U1.M18(MDIO_CLK/TIMER5/UART5_TXD/UART3_RTSN/MMC0_SDWP/MMC1_CLK/MMC2_CLK/GPIO0_1) ; port MDC
MDIO: U1.M17(MDIO_DATA/TIMER6/UART5_RXD/UART3_CTSN/MMC0_SDCD/MMC1_CMD/MMC2_CMD/GPIO0_0) ; port MDIO
SP_VIN: RN3.7(B) RN4.6(B) ; port SP_VIN
TS1_CLK: U1.D16(UART1_RXD/MMC1_SDWP/DCAN1_TX/I2C1_SDA/PR1_UART0_RXD/PR1_PRU1_PRU_R31_16/GPIO0_14) ; port TS1_CLK
TS1_ERR: U1.R5(LCD_HSYNC/GPMC_A9//PR1_EDIO_DATA_IN3/PR1_EDIO_DATA_OUT3/PR1_PRU1_PRU_R30_9/PR1_PRU1_PRU_R31_9/GPIO2_23) ; port TS1_ERR
TS1_SOP: U1.R6(LCD_AC_BIAS_EN/GPMC_A11/PR1_MII1_CRS/PR1_EDIO_DATA_IN5/PR1_EDIO_DATA_OUT5/PR1_PRU1_PRU_R30_11/PR1_PRU1_PRU_R31_11/GPIO2_25) ; port TS1_SOP
TS1_VAL: U1.U5(LCD_VSYNC/GPMC_A8//PR1_EDIO_DATA_IN2/PR1_EDIO_DATA_OUT2/PR1_PRU1_PRU_R30_8/PR1_PRU1_PRU_R31_8/GPIO2_22) ; port TS1_VAL
U0_CTS: U1.E18(UART0_CTSn/UART4_RXD/DCAN1_TX/I2C1_SDA/SPI1_D0/TIMER7/PR1_EDC_SYNC0_OUT/GPIO1_8) ; port U0_CTS
U0_RTS: U1.E17(UART0_RTSn/UART4_TXD/DCAN1_RX/I2C1_SCL/SPI1_D1/SPI1_CS0/PR1_EDC_SYNC1_OUT/GPIO1_9) ; port U0_RTS
U0_RXD: U1.E15(UART0_RXD/SPI1_CS0/DCAN0_TX/I2C2_SDA/ECAP2_IN_PWM2_OUT/PR1_PRU1_PRU_R30_14/PR1_PRU1_PRU_R31_14/GPIO1_10) ; port U0_RXD
U0_TXD: U1.E16(UART0_TXD/SPI1_CS1/DCAN0_RX/I2C2_SCL/ECAP1_IN_PWM1_OUT/PR1_PRU1_PRU_R30_15/PR1_PRU1_PRU_R31_15/GPIO1_11) ; port U0_TXD
UD_VIN: RN3.6(B) RN4.7(B) ; port UD_VIN
USB0_N: U1.N18(USB0_DM) ; port USB0_N
USB0_P: U1.N17(USB0_DP) ; port USB0_P
NetR1_1: R1.1 RN1.5(B) RN9.8(B) SW4.1
NetRN3_1: RN3.1(A) U1.B6(AIN0)
NetRN3_2: RN3.2(A) U1.C7(AIN1)
NetRN3_3: RN3.3(A) U1.B7(AIN2)
NetRN3_4: RN3.4(A) U1.A7(AIN3)
NetU1_F16: U1.F16(GPIO0_18/USB0_DRVVBUS) U24#1.3(EN)

Not connected (* = marked no-connect by the designer): U1 A8(AIN6) A16(SPI0_CS0/MMC2_SDWP/I2C1_SCL/EHRPWM0_SYNCI/PR1_UART0_TXD/PR1_EDIO_DATA_IN1/PR1_EDIO_DATA_OUT1/GPIO0_5) A17(SPI0_SCLK/UART2_RXD/I2C2_SDA/EHRPWM0A/PR1_UART0_CTS_N/PR1_EDIO_SOF/EMU2/GPIO0_2) B8(AIN5) B12(MCASP0_ACLKR/EQEP0A_IN/MCASP0_AXR2/MCASP1_ACLKX/MMC0_SDWP/PR1_PRU0_PRU_R30_4/PR1_PRU0_PRU_R31_4/GPIO3_18) B16(SPI0_D1/MMC1_SDWP/I2C1_SDA/EHRPWM0_TRIPZONE_INPUT/PR1_UART0_RXD/PR1_EDIO_DATA_IN0/PR1_EDIO_DATA_OUT0/GPIO0_4) B17(SPI0_D0/UART2_TXD/I2C2_SCL/EHRPWM0B/PR1_UART0_RTS_N/PR1_EDIO_LATCH_IN/EMU3/GPIO0_3) C8(AIN4) C9(AIN7) C13(MCASP0_FSR/EQEP0B_IN/MCASP0_AXR3/MCASP1_FSX/EMU2/PR1_PRU0_PRU_R30_5/PR1_PRU0_PRU_R31_5/GPIO3_19) C18(ECAP0_IN_PWM0_OUT/UART3_TXD/SPI1_CS1/PR1_ECAP0_ECAP_CAPIN_APWM_O/SPI1_SCLK/MMC0_SDWP/XDMA_EVENT_INTR2/GPIO0_7) D13(MCASP0_AXR1/EQEP0_INDEX//MCASP1_AXR0/EMU3/PR1_PRU0_PRU_R30_6/PR1_PRU0_PRU_R31_6/GPIO3_20) D15(UART1_TXD/MMC2_SDWP/DCAN1_RX/I2C1_SCL/PR1_UART0_TXD/PR1_PRU0_PRU_R31_16/GPIO0_15) D17(UART1_RTSn/TIMER5/DCAN0_RX/I2C2_SCL/SPI1_CS1/PR1_UART0_RTSn/PR1_EDC_LATCH1_IN/GPIO0_13) F15(GPIO3_13/USB1_DRVVBUS) H16(GMII1_COL/RMII2_REFCLK/SPI1_SCLK/UART5_RXD/MCASP1_AXR2/MMC2_DAT3/MCASP0_AXR2/GPIO3_0) J17(GMII1_RXDV/LCD_MEMORY_CLK/RGMII1_RCTL/UART5_TXD/MCASP1_ACLKX/MMC2_DAT0/MCASP0_ACLKR/GPIO3_4) J18(GMII1_TXD3/DCAN0_TX/RGMII1_TD3/UART4_RXD/MCASP1_FSX/MMC2_DAT1/MCASP0_FSR/GPIO0_16) K15(GMII1_TXD2/DCAN0_RX/RGMII1_TD2/UART4_TXD/MCASP1_AXR0/MMC2_DAT2/MCASP0_AHCLKX/GPIO0_17) K18(GMII1_TXCLK/UART2_RXD/RGMII1_TCLK/MMC0_DAT7/MMC1_DAT0/UART1_DCDn/MCASP0_ACLKX/GPIO3_9) L16(GMII1_RXD2/UART3_TXD/RGMII1_RD2/MMC0_DAT4/MMC1_DAT3/UART1_RIN/MCASP0_AXR1/GPIO2_19) L17(GMII1_RXD3/UART3_RXD/RGMII1_RD3/MMC0_DAT5/MMC1_DAT2/UART1_DTRN/MCASP0_AXR0/GPIO2_18) L18(GMII1_RXCLK/UART2_TXD/RGMII1_RCLK/MMC0_DAT6/MMC1_DAT1/UART1_DSRN/MCASP0_FSX/GPIO3_10) M15(USB0_CE) P17(USB1_ID) P18(USB1_CE) R17(USB1_DP) R18(USB1_DM) T18(USB1_VBUS)

### Layout directives
differential pair: USB0_N, USB0_P

### Notes on the sheet
- (near R1) SYSBOOT[4:0] = BOOT ORDER
- (near SW4) SYSBOOT5 = CLKOUT1 CTL
- SYSBOOT[15:14] = FREQ
- ALL OTHERS = 0
- OUTERNET INC. - LANTERN PROJECT
- Title:
- Size:
- Date:
- B
- Engineer:
- Time:
- Rev:
- Sheet
- of
- File:

### Library data of the parts
C142 = 0.1UF_16V, 0402: CAP - 0402 PKG
R1 = 1K, 0402: RES - 0402 PKG
RN1 RN3 RN4 RN9-RN11 = 10KNI, EXB-28V: RES NET, 4 INDIVIDUAL, EXB-28V
SW4 = ALP_SKQM: SWITCH - PUSHBUTTON SMT, 6MM X 3.5MM
U1 = AM3358BZCZA100: as U1 on sheet ddr3_if
U24#1 = MIC94060, SC-70-6: IC - POWER SWITCH, 1.7V - 5.5V @ 2A, HIGH TRUE

## Sheet enet_phy.SchDoc: 10/100 Copper PHY
size B; Engineer: Michael J. Kelly; Organization: CSB540otn - Outernet; Address1: AM335x Compute Board; Address2: (C) 2015; Address3: See us on the Web:; Address4: http://outernet.is; DocumentNumber: 5; Revision: V1.0; SheetNumber: 5; SheetTotal: 9
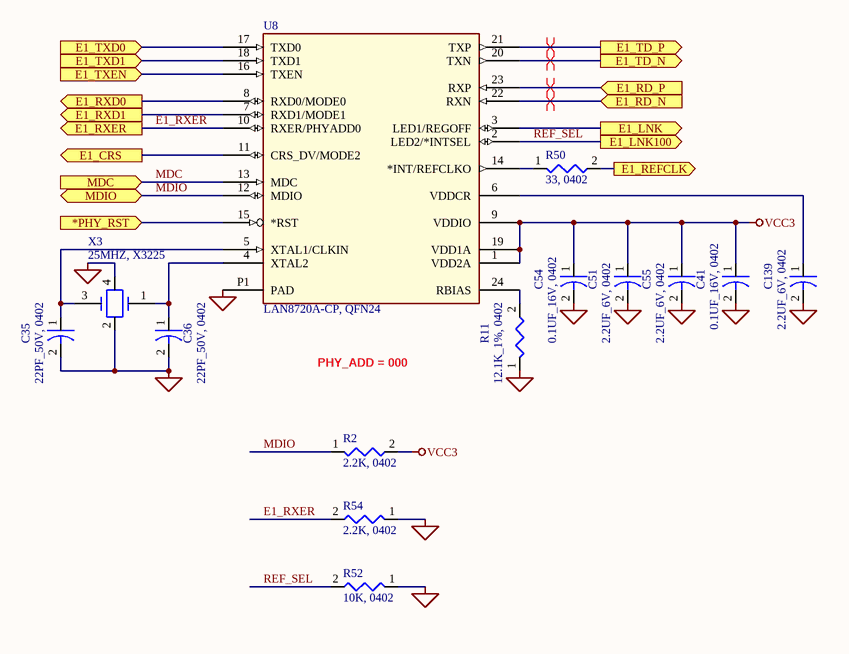
[diagram p3: enet_phy.SchDoc]

### Parts
C35  22PF_50V, 0402  [0402C]
C36  22PF_50V, 0402  [0402C]
C41  0.1UF_16V, 0402  [0402C]
C51  2.2UF_6V, 0402  [0402C]
C54  0.1UF_16V, 0402  [0402C]
C55  2.2UF_6V, 0402  [0402C]
C139  2.2UF_6V, 0402  [0402C]
R2  2.2K, 0402  [0402R]
R11  12.1K_1%, 0402  [0402R]
R50  33, 0402  [0402R]
R52  10K, 0402  [0402R]
R54  2.2K, 0402  [0402R]
U8  LAN8720A-CP, QFN24  [QFN24]
X3  25MHZ, X3225  [X3225]

### Ports
*PHY_RST (in), E1_CRS (out), E1_LNK100 (out), E1_LNK (out), E1_RD_N (in), E1_RD_P (in), E1_REFCLK (out), E1_RXD0 (out), E1_RXD1 (out), E1_RXER (out), E1_TD_N (out), E1_TD_P (out), E1_TXD0 (in), E1_TXD1 (in), E1_TXEN (in), MDC (in), MDIO (bidir)

### Nets
GND: C35.2 C36.2 C41.2 C51.2 C54.2 C55.2 C139.2 R11.1 R52.1 R54.1 U8.P1(PAD) X3.2 X3.4
VCC3: C41.1 C51.1 C54.1 C55.1 R2.2 U8.1(VDD2A) U8.9(VDDIO) U8.19(VDD1A)
*PHY_RST: U8.15(*RST) ; port *PHY_RST
E1_CRS: U8.11(CRS_DV/MODE2) ; port E1_CRS
E1_LNK: U8.3(LED1/REGOFF) ; port E1_LNK
E1_RD_N: U8.22(RXN) ; port E1_RD_N
E1_RD_P: U8.23(RXP) ; port E1_RD_P
E1_REFCLK: R50.2 ; port E1_REFCLK
E1_RXD0: U8.8(RXD0/MODE0) ; port E1_RXD0
E1_RXD1: U8.7(RXD1/MODE1) ; port E1_RXD1
E1_RXER: R54.2 U8.10(RXER/PHYADD0) ; port E1_RXER
E1_TD_N: U8.20(TXN) ; port E1_TD_N
E1_TD_P: U8.21(TXP) ; port E1_TD_P
E1_TXD0: U8.17(TXD0) ; port E1_TXD0
E1_TXD1: U8.18(TXD1) ; port E1_TXD1
E1_TXEN: U8.16(TXEN) ; port E1_TXEN
MDC: U8.13(MDC) ; port MDC
MDIO: R2.1 U8.12(MDIO) ; port MDIO
REF_SEL: R52.2 U8.2(LED2/*INTSEL) ; port E1_LNK100
NetC35_1: C35.1 U8.5(XTAL1/CLKIN) X3.3
NetC36_1: C36.1 U8.4(XTAL2) X3.1
NetC139_1: C139.1 U8.6(VDDCR)
NetR11_2: R11.2 U8.24(RBIAS)
NetR50_1: R50.1 U8.14(*INT/REFCLKO)

### Layout directives
differential pair: E1_RD_N, E1_RD_P, E1_TD_N, E1_TD_P

### Notes on the sheet
- PHY_ADD = 000
- OUTERNET INC. - LANTERN PROJECT
- Title:
- Size:
- Date:
- B
- Engineer:
- Time:
- Rev:
- Sheet
- of
- File:

### Library data of the parts
C35 C36 = 22PF_50V, 0402: CAP - 0402 PKG
C41 C54 = 0.1UF_16V, 0402: CAP - 0402 PKG
C51 C55 C139 = 2.2UF_6V, 0402: CAP - 0402 PKG
R2 R54 = 2.2K, 0402: RES - 0402 PKG
R11 = 12.1K_1%, 0402: RES - 0402 PKG
R50 = 33, 0402: RES - 0402 PKG
R52 = 10K, 0402: RES - 0402 PKG
U8 = LAN8720A-CP, QFN24: PHY - 10/100 RMII
X3 = 25MHZ, X3225: CRYSTAL - SMT, 3.2MM x 2.5MM, ABM8 PKG

## Sheet rf_mods.SchDoc: CPU I/O Connectors
size B; Engineer: Michael J. Kelly; Organization: CSB540otn - Outernet; Address1: AM335x Compute Board; Address2: (C) 2015; Address3: See us on the Web:; Address4: http://outernet.is; DocumentNumber: 6; Revision: V1.0; SheetNumber: 6; SheetTotal: 9
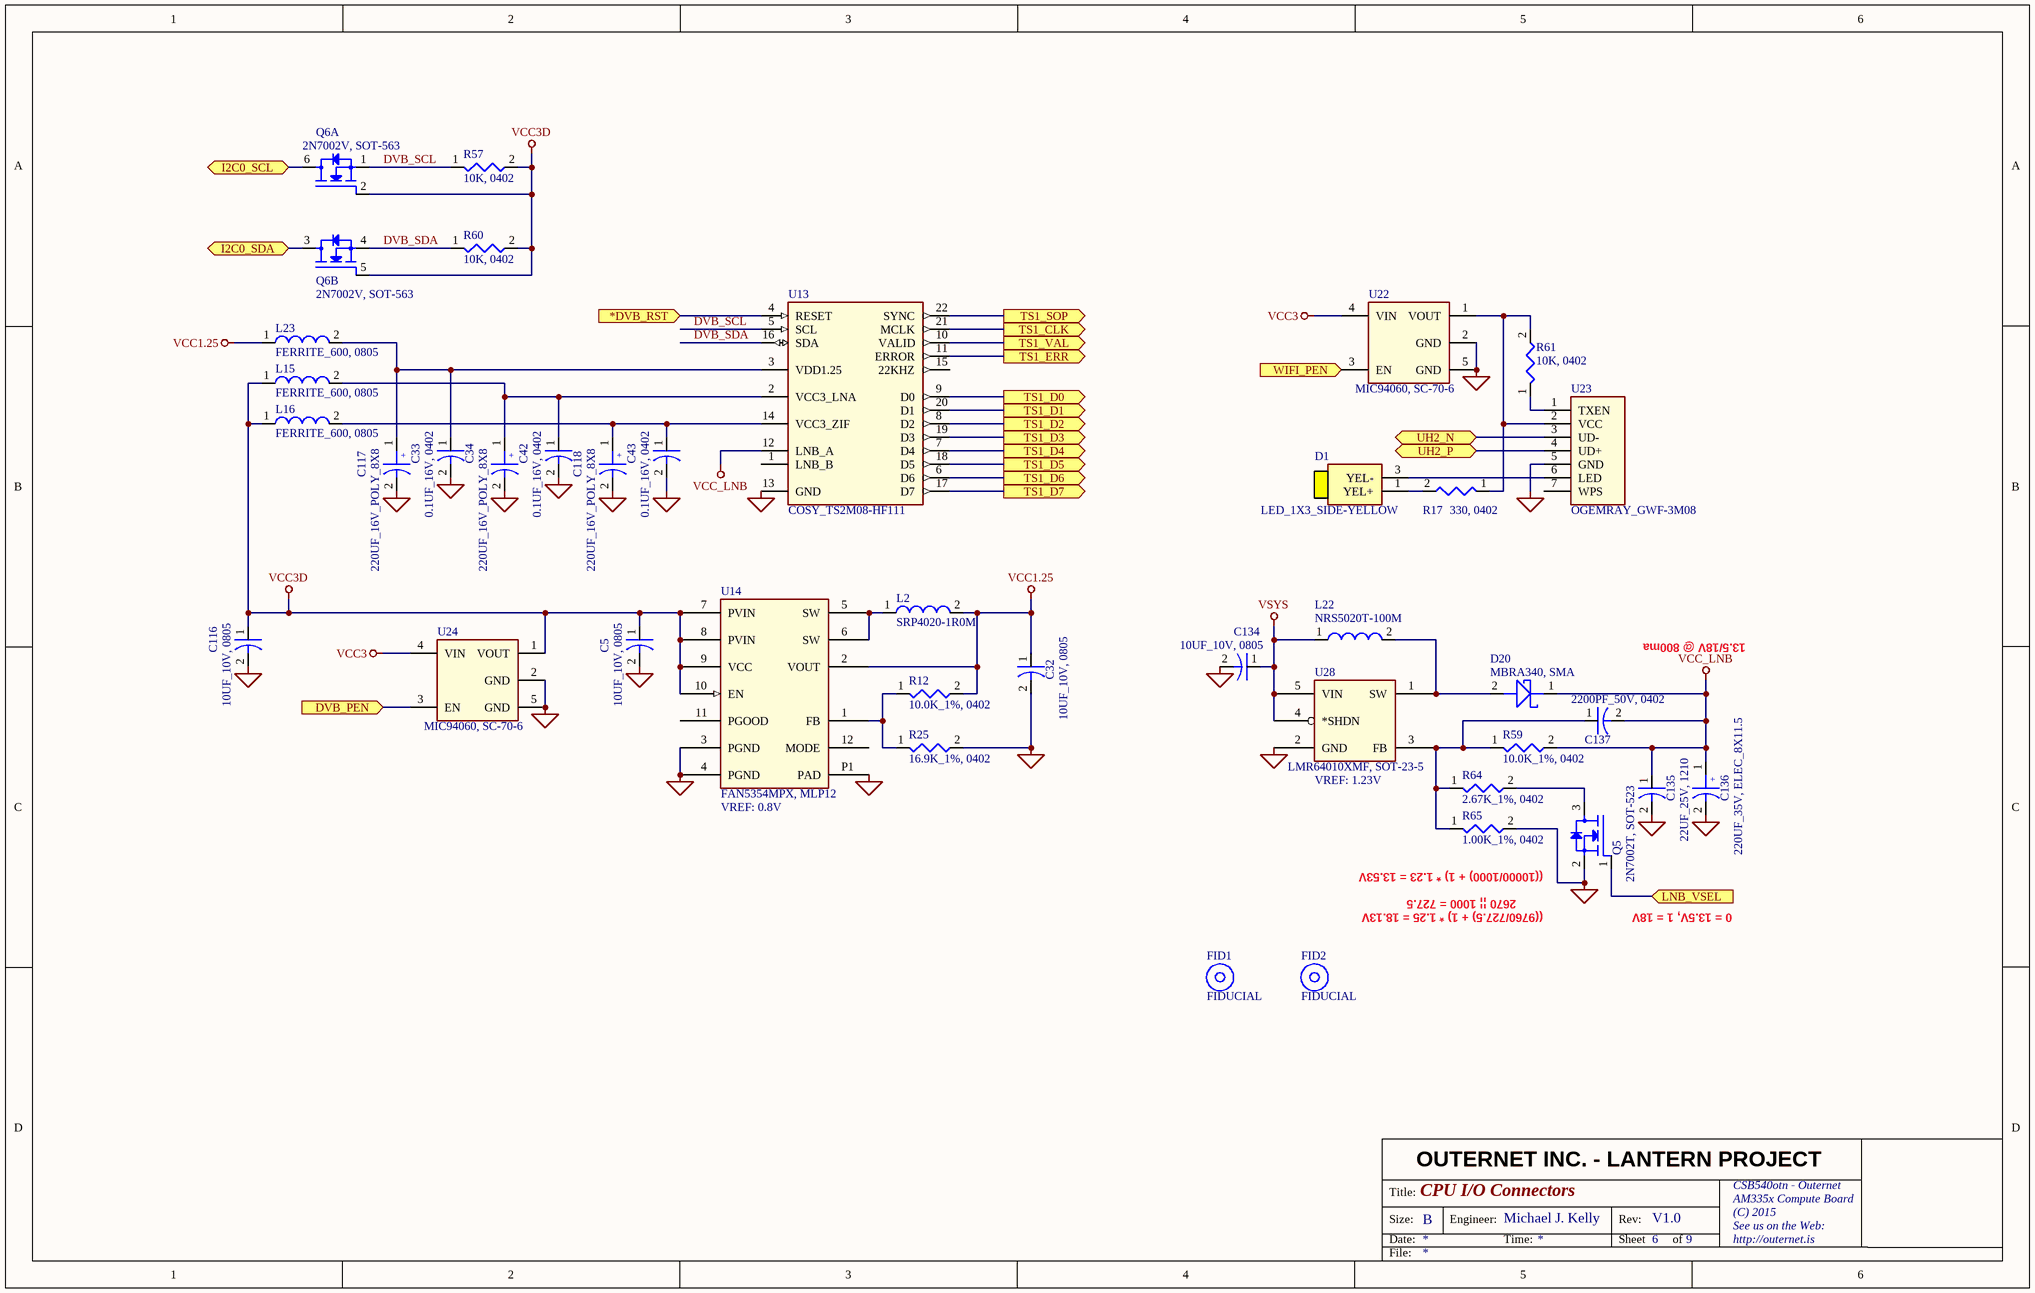
[diagram p4: rf_mods.SchDoc]

### Parts
(Parts that share a designator on the sheet are numbered #1, #2 ... from top to bottom, then left to right.)
C5  10UF_10V, 0805  [0805C]
C32  10UF_10V, 0805  [0805C]
C33  0.1UF_16V, 0402  [0402C]
C34  220UF_16V_POLY_8X8  [ELEC_8MM_8MM]
C42  0.1UF_16V, 0402  [0402C]
C43  0.1UF_16V, 0402  [0402C]
C116  10UF_10V, 0805  [0805C]
C117  220UF_16V_POLY_8X8  [ELEC_8MM_8MM]
C118  220UF_16V_POLY_8X8  [ELEC_8MM_8MM]
C134  10UF_10V, 0805  [0805C]
C135  22UF_25V, 1210  [1210C]
C136  220UF_35V, ELEC_8X11.5  [ELEC_8MM_11.5MM]
C137  2200PF_50V, 0402  [0402C]
D1  LED_1X3_SIDE-YELLOW  [LED_1X3_SIDE-YELLOW]
D20  MBRA340, SMA  [SMA]
FID1  FIDUCIAL  [FIDUCIAL]
FID2  FIDUCIAL  [FIDUCIAL]
L2  SRP4020-1R0M  [SRP4020]
L15  FERRITE_600, 0805  [0805L]
L16  FERRITE_600, 0805  [0805L]
L22  NRS5020T-100M  [NRS5020T]
L23  FERRITE_600, 0805  [0805L]
Q5  2N7002T, SOT-523  [SOT-523]
Q6  2N7002V, SOT-563  [SOT-563]  (parts A,B of 2)
R12  10.0K_1%, 0402  [0402R]
R17  330, 0402  [0402R]
R25  16.9K_1%, 0402  [0402R]
R57  10K, 0402  [0402R]
R59  10.0K_1%, 0402  [0402R]
R60  10K, 0402  [0402R]
R61  10K, 0402  [0402R]
R64  2.67K_1%, 0402  [0402R]
R65  1.00K_1%, 0402  [0402R]
U13  COSY_TS2M08-HF111  [TS2M08-HFF11]
U14  FAN5354MPX, MLP12  VREF: 0.8V  [mlp12]
U22  MIC94060, SC-70-6  [SOT-363/SC-70-6]
U23  OGEMRAY_GWF-3M08  [OGEMRAY_GWF-3M08-XX-T-2]
U24#2  MIC94060, SC-70-6  [SOT-363/SC-70-6]
U28  LMR64010XMF, SOT-23-5  VREF: 1.23V  [SOT-23-5]

### Ports
*DVB_RST (in), DVB_PEN (in), I2C0_SCL (bidir), I2C0_SDA (bidir), LNB_VSEL (in), TS1_CLK (out), TS1_D0 (out), TS1_D1 (out), TS1_D2 (out), TS1_D3 (out), TS1_D4 (out), TS1_D5 (out), TS1_D6 (out), TS1_D7 (out), TS1_ERR (out), TS1_SOP (out), TS1_VAL (out), UH2_N (bidir), UH2_P (bidir), WIFI_PEN (in)

### Nets
GND: C5.2 C32.2 C33.2 C34.2 C42.2 C43.2 C116.2 C117.2 C118.2 C134.2 C135.2 C136.2 Q5.2(SOURCE) R25.2 R65.2 U13.13(GND) U14.3(PGND) U14.4(PGND) U14.P1(PAD) U22.2(GND) U22.5(GND) U23.5(GND) U24#2.2(GND) U24#2.5(GND) U28.2(GND)
VCC1.25: C32.1 L2.2 L23.1 R12.2 U14.2(VOUT)
VCC3: U22.4(VIN) U24#2.4(VIN)
VCC3D: C5.1 C116.1 L15.1 L16.1 Q6.2 Q6.5 R57.2 R60.2 U14.7(PVIN) U14.8(PVIN) U14.9(VCC) U14.10(EN) U24#2.1(VOUT)
VCC_LNB: C135.1 C136.1 C137.2 D20.1(CATHODE) R59.2 U13.12(LNB_A)
VSYS: C134.1 L22.1 U28.4(*SHDN) U28.5(VIN)
*DVB_RST: U13.4(RESET) ; port *DVB_RST
CFG0: U13.9(D0) ; port TS1_D0
CFG1: U13.20(D1) ; port TS1_D1
CFG2: U13.8(D2) ; port TS1_D2
CFG3: U13.19(D3) ; port TS1_D3
CFG4: U13.7(D4) ; port TS1_D4
CFG5: U13.18(D5) ; port TS1_D5
CFG6: U13.6(D6) ; port TS1_D6
CFG7: U13.17(D7) ; port TS1_D7
CFG12: U24#2.3(EN) ; port DVB_PEN
CFG13: U22.3(EN) ; port WIFI_PEN
DVB_SCL: Q6.1 R57.1 U13.5(SCL)  [project net DVB_SCL_6]
DVB_SDA: Q6.4 R60.1 U13.16(SDA)  [project net DVB_SDA_6]
I2C0_SCL: Q6.6 ; port I2C0_SCL
I2C0_SDA: Q6.3 ; port I2C0_SDA
LNB_VSEL: Q5.1(GATE) ; port LNB_VSEL
TS1_CLK: U13.21(MCLK) ; port TS1_CLK
TS1_ERR: U13.11(ERROR) ; port TS1_ERR
TS1_SOP: U13.22(SYNC) ; port TS1_SOP
TS1_VAL: U13.10(VALID) ; port TS1_VAL
UH2_N: U23.3(UD-) ; port UH2_N
UH2_P: U23.4(UD+) ; port UH2_P
NetC33_1: C33.1 C117.1 L23.2 U13.3(VDD1.25)
NetC34_1: C34.1 C42.1 L15.2 U13.2(VCC3_LNA)
NetC43_1: C43.1 C118.1 L16.2 U13.14(VCC3_ZIF)
NetC137_1: C137.1 R59.1 R64.1 R65.1 U28.3(FB)
NetD1_1: D1.1(YEL+) R17.2
NetD1_3: D1.3(YEL-) U23.6(LED)
NetD20_2: D20.2(ANODE) L22.2 U28.1(SW)
NetL2_1: L2.1 U14.5(SW) U14.6(SW)
NetQ5_3: Q5.3(DRAIN) R64.2
NetR12_1: R12.1 R25.1 U14.1(FB)
NetR17_1: R17.1 R61.2 U22.1(VOUT) U23.2(VCC)
NetR61_1: R61.1 U23.1(TXEN)

Not connected (* = marked no-connect by the designer): U13 1(LNB_B) 15(22KHZ); U14 11(PGOOD) 12(MODE); U23 7(WPS)

### Notes on the sheet
- 13.5/18V @ 800ma
- 2670 || 1000 = 727.5
- ((10000/1000) + 1) * 1.23 = 13.53V
- ((9760/727.5) + 1) * 1.25 = 18.13V
- 0 = 13.5V, 1 = 18V
- OUTERNET INC. - LANTERN PROJECT
- Title:
- Size:
- Date:
- B
- Engineer:
- Time:
- Rev:
- Sheet
- of
- File:
- (in symbol 220UF_16V_POLY_8X8) +
- (in symbol 220UF_35V, ELEC_8X11.5) +

### Library data of the parts
C5 C32 C116 C134 = 10UF_10V, 0805: CAP - 0805 PKG
C33 C42 C43 = 0.1UF_16V, 0402: CAP - 0402 PKG
C34 C117 C118 = 220UF_16V_POLY_8X8: CAP - ELEC_POLY, 8mm x 8mm x 3.5mm
C135 = 22UF_25V, 1210: CAP - 1210 PKG
C136 = 220UF_35V, ELEC_8X11.5: CAP - ELEC, 8mm x 11.5mm x 3.5mm
C137 = 2200PF_50V, 0402: CAP - 0402 PKG
D1 = LED_1X3_SIDE-YELLOW: LED - SIDEVIEW, SMT, YELLOW
D20 = MBRA340, SMA: DIODE - POWER, SCHOTTKY, 40V, 3A
FID1 FID2 = FIDUCIAL: MISC - 75mm/35mm FIDUCIAL
L2 = SRP4020-1R0M: as L18 on sheet ddr3_if
L15 L16 L23 = FERRITE_600, 0805: FERRITE BEAD - 600 OHM, 2A, 0805 PKG
L22 = NRS5020T-100M: INDUCTOR - 10UH, 1.3A/1.45A, 5MM x 5MM x 2MM
Q5 = 2N7002T, SOT-523: N-FET - 60V, 500ma @ 10V, Vgs(th) 2V
Q6 = 2N7002V, SOT-563: N-FET - DUAL, 60V, 500ma @ 10V, Vgs(th) 2V
R12 R59 = 10.0K_1%, 0402: RES - 0402 PKG
R17 = 330, 0402: RES - 0402 PKG
R25 = 16.9K_1%, 0402: RES - 0402 PKG
R57 R60 R61 = 10K, 0402: RES - 0402 PKG
R64 = 2.67K_1%, 0402: RES - 0402 PKG
R65 = 1.00K_1%, 0402: RES - 0402 PKG
U13 = COSY_TS2M08-HF111: RF - MODULE, DVB-S2 TUNER/DEMODULATOR
U14 = FAN5354MPX, MLP12: as U20 on sheet ddr3_if
U22 U24#2 = MIC94060, SC-70-6: as U24#1 on sheet cpu_io
U23 = OGEMRAY_GWF-3M08: MODULE - WIFI, RALINK RT5370 802.11b/g/n
U28 = LMR64010XMF, SOT-23-5: SWITCHER - BOOST, 1ma Iq, 2.7V TO 14V IN, VIN TO 40V OUT

## Sheet io_conn.SchDoc: CPU I/O and USB Connectors
size B; Engineer: Michael J. Kelly; Organization: CSB540otn - Outernet; Address1: AM335x Compute Board; Address2: (C) 2015; Address3: See us on the Web:; Address4: http://outernet.is; DocumentNumber: 7; Revision: V1.0; SheetNumber: 7; SheetTotal: 9
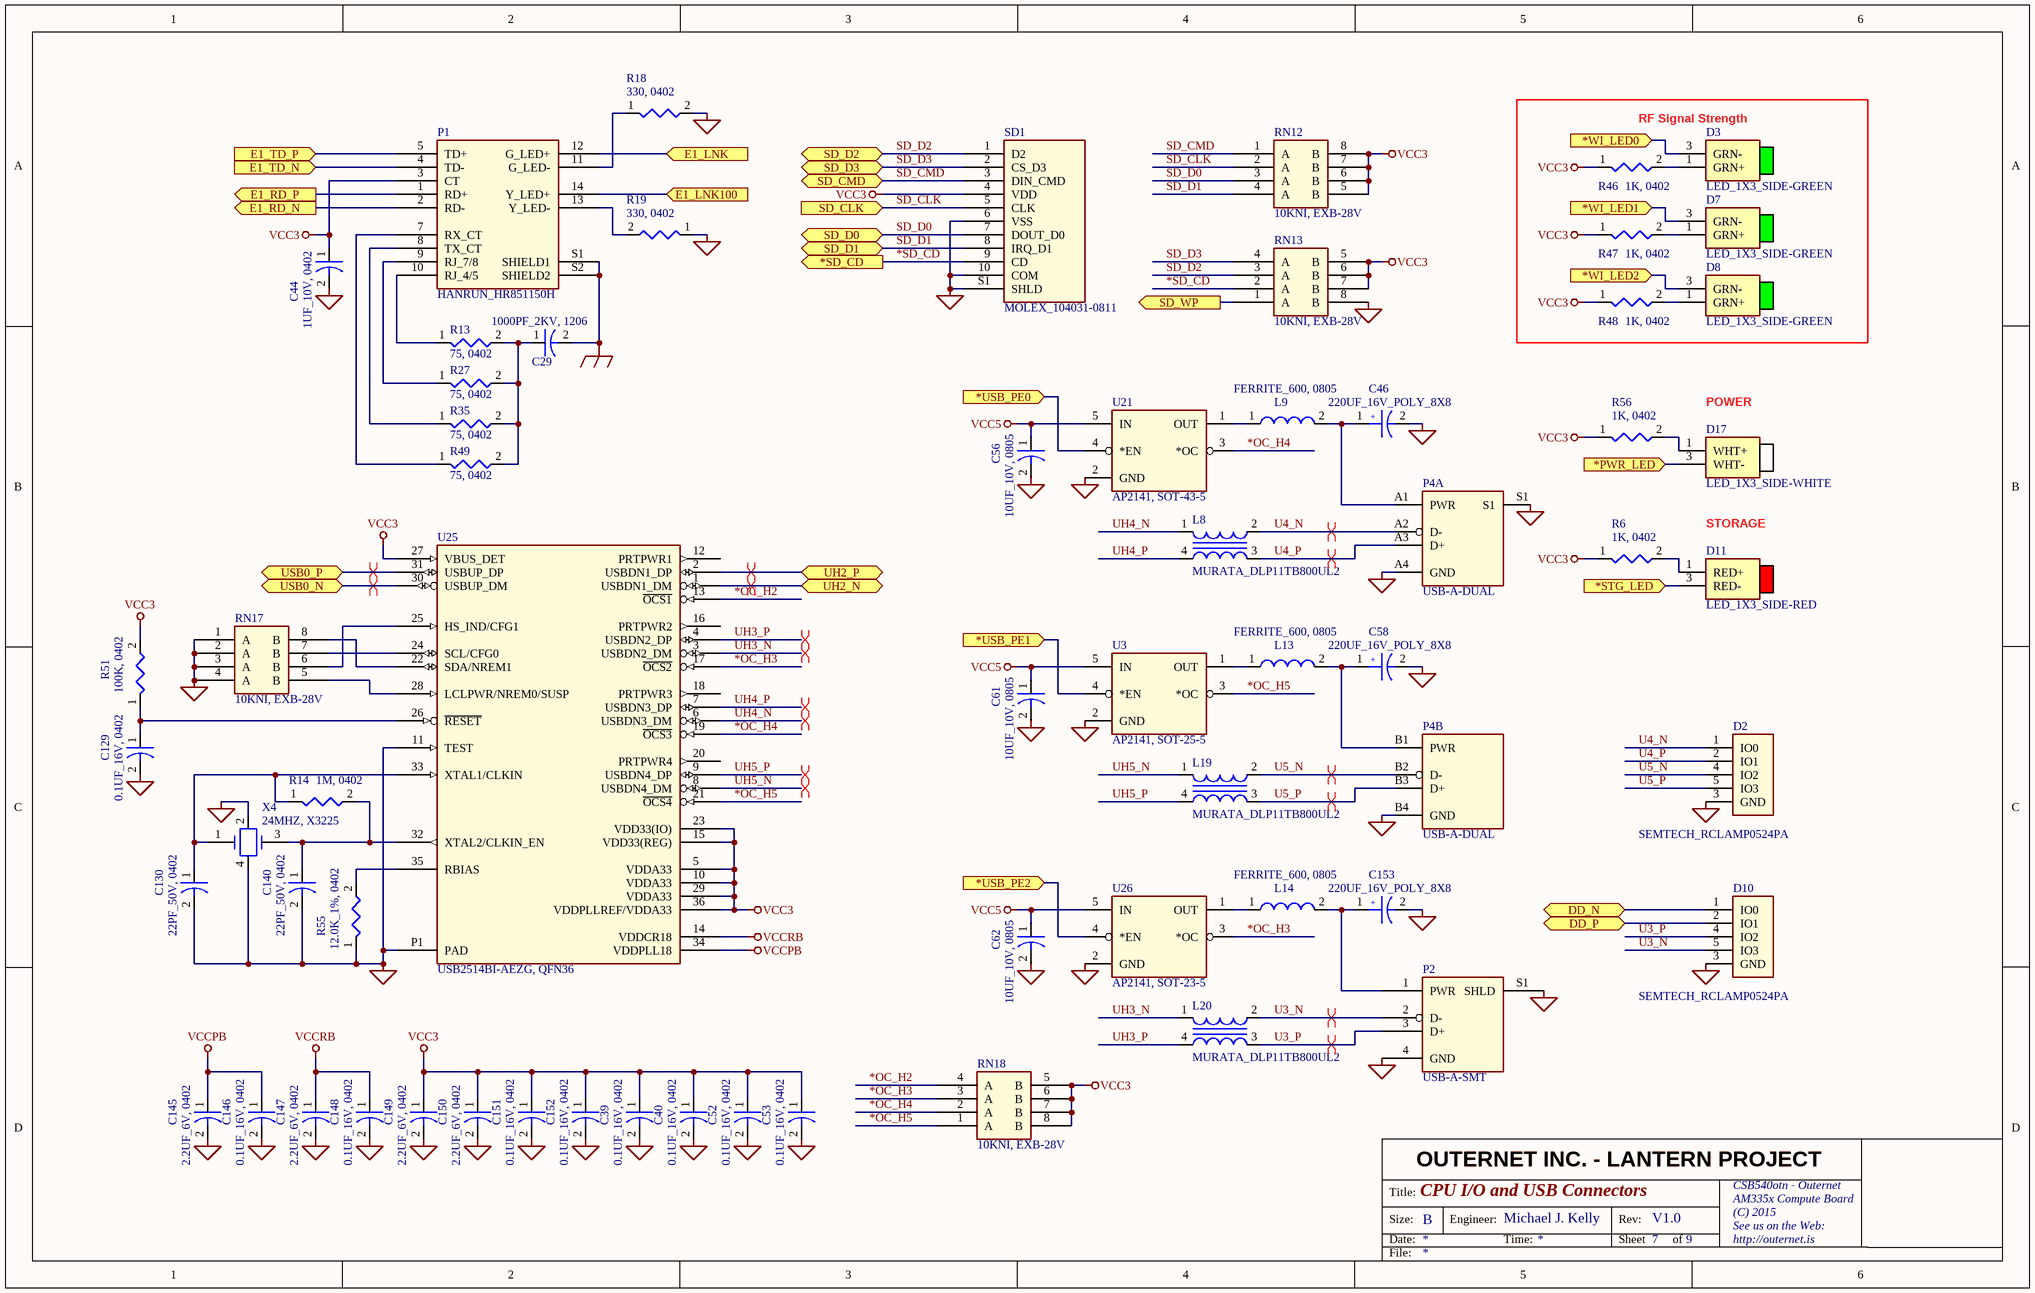
[diagram p5: io_conn.SchDoc]

### Parts
C29  1000PF_2KV, 1206  [1206C]
C39  0.1UF_16V, 0402  [0402C]
C40  0.1UF_16V, 0402  [0402C]
C44  1UF_10V, 0402  [0402C]
C46  220UF_16V_POLY_8X8  [ELEC_8MM_8MM]
C52  0.1UF_16V, 0402  [0402C]
C53  0.1UF_16V, 0402  [0402C]
C56  10UF_10V, 0805  [0805C]
C58  220UF_16V_POLY_8X8  [ELEC_8MM_8MM]
C61  10UF_10V, 0805  [0805C]
C62  10UF_10V, 0805  [0805C]
C129  0.1UF_16V, 0402  [0402C]
C130  22PF_50V, 0402  [0402C]
C140  22PF_50V, 0402  [0402C]
C145  2.2UF_6V, 0402  [0402C]
C146  0.1UF_16V, 0402  [0402C]
C147  2.2UF_6V, 0402  [0402C]
C148  0.1UF_16V, 0402  [0402C]
C149  2.2UF_6V, 0402  [0402C]
C150  2.2UF_6V, 0402  [0402C]
C151  0.1UF_16V, 0402  [0402C]
C152  0.1UF_16V, 0402  [0402C]
C153  220UF_16V_POLY_8X8  [ELEC_8MM_8MM]
D2  SEMTECH_RCLAMP0524PA  [RCLAMP0524]
D3  LED_1X3_SIDE-GREEN  [LED_1X3_SIDE-GREEN]
D7  LED_1X3_SIDE-GREEN  [LED_1X3_SIDE-GREEN]
D8  LED_1X3_SIDE-GREEN  [LED_1X3_SIDE-GREEN]
D10  SEMTECH_RCLAMP0524PA  [RCLAMP0524]
D11  LED_1X3_SIDE-RED  [LED_1X3_SIDE-RED]
D17  LED_1X3_SIDE-WHITE  [LED_1X3_SIDE-WHITE]
L8  MURATA_DLP11TB800UL2  [PANASONIC_EXC24C]
L9  FERRITE_600, 0805  [0805L]
L13  FERRITE_600, 0805  [0805L]
L14  FERRITE_600, 0805  [0805L]
L19  MURATA_DLP11TB800UL2  [PANASONIC_EXC24C]
L20  MURATA_DLP11TB800UL2  [PANASONIC_EXC24C]
P1  HANRUN_HR851150H  [SPEEDTECH_P65-101-1HQ9]
P2  USB-A-SMT  [USB-A-SMT]
P4  USB-A-DUAL  [USB-A-DUAL]  (parts A,B of 2)
R6  1K, 0402  [0402R]
R13  75, 0402  [0402R]
R14  1M, 0402  [0402R]
R18  330, 0402  [0402R]
R19  330, 0402  [0402R]
R27  75, 0402  [0402R]
R35  75, 0402  [0402R]
R46  1K, 0402  [0402R]
R47  1K, 0402  [0402R]
R48  1K, 0402  [0402R]
R49  75, 0402  [0402R]
R51  100K, 0402  [0402R]
R55  12.0K_1%, 0402  [0402R]
R56  1K, 0402  [0402R]
RN12  10KNI, EXB-28V  [EXB-28V]
RN13  10KNI, EXB-28V  [EXB-28V]
RN17  10KNI, EXB-28V  [EXB-28V]
RN18  10KNI, EXB-28V  [EXB-28V]
SD1  MOLEX_104031-0811  [MOLEX_104031-0811]
U3  AP2141, SOT-25-5  [SOT-23-5]
U21  AP2141, SOT-43-5  [SOT-23-5]
U25  USB2514BI-AEZG, QFN36  [QFN36]
U26  AP2141, SOT-23-5  [SOT-23-5]
X4  24MHZ, X3225  [X3225]

### Blocks framed on the sheet
RF Signal Strength: D3 D7 D8 R46-R48

### Ports
*PWR_LED (in), *SD_CD (out), *STG_LED (in), *USB_PE0 (in), *USB_PE1 (in), *USB_PE2 (in), *WI_LED0 (in), *WI_LED1 (in), *WI_LED2 (in), DD_N (bidir), DD_P (bidir), E1_LNK100 (in), E1_LNK (in), E1_RD_N (out), E1_RD_P (out), E1_TD_N (in), E1_TD_P (in), SD_CLK (in), SD_CMD (bidir), SD_D0 (bidir), SD_D1 (bidir), SD_D2 (bidir), SD_D3 (bidir), SD_WP (out), UH2_N (bidir), UH2_P (bidir), USB0_N (bidir), USB0_P (bidir)

### Nets
EARTH: C29.2 P1.S1(SHIELD1) P1.S2(SHIELD2)
GND: C39.2 C40.2 C44.2 C46.2 C52.2 C53.2 C56.2 C58.2 C61.2 C62.2 C129.2 C130.2 C140.2 C145.2 C146.2 C147.2 C148.2 C149.2 C150.2 C151.2 C152.2 C153.2 D2.3(GND) D10.3(GND) P2.4(GND) P2.S1(SHLD) P4.A4(GND) P4.B4(GND) P4.S1 R18.2 R19.1 R55.1 RN13.8(B) RN17.1(A) RN17.2(A) RN17.3(A) RN17.4(A) SD1.6(VSS) SD1.10(COM) SD1.S1(SHLD) U3.2(GND) U21.2(GND) U25.11(TEST) U25.P1(PAD) U26.2(GND) X4.2 X4.4
VCC3: C39.1 C40.1 C44.1 C52.1 C53.1 C149.1 C150.1 C151.1 C152.1 P1.3(CT) R6.1 R46.1 R47.1 R48.1 R51.2 R56.1 RN12.5(B) RN12.6(B) RN12.7(B) RN12.8(B) RN13.5(B) RN13.6(B) RN13.7(B) RN18.5(B) RN18.6(B) RN18.7(B) RN18.8(B) SD1.4(VDD) U25.5(VDDA33) U25.10(VDDA33) U25.15(VDD33(REG)) U25.23(VDD33(IO)) U25.27(VBUS_DET) U25.29(VDDA33) U25.36(VDDPLLREF/VDDA33)
VCC5: C56.1 C61.1 C62.1 U3.5(IN) U21.5(IN) U26.5(IN)
VCCPB: C145.1 C146.1 U25.34(VDDPLL18)
VCCRB: C147.1 C148.1 U25.14(VDDCR18)
*OC_H2: RN18.4(A) U25.13(~{OCS1})  [project net *OC_H2_7]
*OC_H3: RN18.3(A) U25.17(~{OCS2}) U26.3(*OC)  [project net *OC_H3_7]
*OC_H4: RN18.2(A) U21.3(*OC) U25.19(~{OCS3})  [project net *OC_H4_7]
*OC_H5: RN18.1(A) U3.3(*OC) U25.21(~{OCS4})  [project net *OC_H5_7]
*PWR_LED: D17.3(WHT-) ; port *PWR_LED
*SD_CD: RN13.2(A) SD1.9(CD) ; port *SD_CD
*STG_LED: D11.3(RED-) ; port *STG_LED
*USB_PE0: U21.4(*EN) ; port *USB_PE0
*USB_PE1: U3.4(*EN) ; port *USB_PE1
*USB_PE2: U26.4(*EN) ; port *USB_PE2
*WI_LED0: D3.3(GRN-) ; port *WI_LED0
*WI_LED1: D7.3(GRN-) ; port *WI_LED1
*WI_LED2: D8.3(GRN-) ; port *WI_LED2
DD_N: D10.1(IO0) ; port DD_N
DD_P: D10.2(IO1) ; port DD_P
E1_LNK: P1.12(G_LED+) ; port E1_LNK
E1_RD_N: P1.2(RD-) ; port E1_RD_N
E1_RD_P: P1.1(RD+) ; port E1_RD_P
E1_TD_N: P1.4(TD-) ; port E1_TD_N
E1_TD_P: P1.5(TD+) ; port E1_TD_P
REF_SEL: P1.14(Y_LED+) ; port E1_LNK100
SD_CLK: RN12.2(A) SD1.5(CLK) ; port SD_CLK
SD_CMD: RN12.1(A) SD1.3(DIN_CMD) ; port SD_CMD
SD_D0: RN12.3(A) SD1.7(DOUT_D0) ; port SD_D0
SD_D1: RN12.4(A) SD1.8(IRQ_D1) ; port SD_D1
SD_D2: RN13.3(A) SD1.1(D2) ; port SD_D2
SD_D3: RN13.4(A) SD1.2(CS_D3) ; port SD_D3
SD_WP: RN13.1(A) ; port SD_WP
U3_N: D10.5(IO3) L20.2 P2.2(D-)  [project net U3_N_7]
U3_P: D10.4(IO2) L20.3 P2.3(D+)  [project net U3_P_7]
U4_N: D2.1(IO0) L8.2 P4.A2(D-)  [project net U4_N_7]
U4_P: D2.2(IO1) L8.3 P4.A3(D+)  [project net U4_P_7]
U5_N: D2.4(IO2) L19.2 P4.B2(D-)  [project net U5_N_7]
U5_P: D2.5(IO3) L19.3 P4.B3(D+)  [project net U5_P_7]
UH2_N: U25.1(USBDN1_DM) ; port UH2_N
UH2_P: U25.2(USBDN1_DP) ; port UH2_P
UH3_N: L20.1 U25.3(USBDN2_DM)  [project net UH3_N_7]
UH3_P: L20.4 U25.4(USBDN2_DP)  [project net UH3_P_7]
UH4_N: L8.1 U25.6(USBDN3_DM)  [project net UH4_N_7]
UH4_P: L8.4 U25.7(USBDN3_DP)  [project net UH4_P_7]
UH5_N: L19.1 U25.8(USBDN4_DM)  [project net UH5_N_7]
UH5_P: L19.4 U25.9(USBDN4_DP)  [project net UH5_P_7]
USB0_N: U25.30(USBUP_DM) ; port USB0_N
USB0_P: U25.31(USBUP_DP) ; port USB0_P
NetC29_1: C29.1 R13.2 R27.2 R35.2 R49.2
NetC46_1: C46.1 L9.2 P4.A1(PWR)
NetC58_1: C58.1 L13.2 P4.B1(PWR)
NetC129_1: C129.1 R51.1 U25.26(~{RESET})
NetC130_1: C130.1 R14.1 U25.33(XTAL1/CLKIN) X4.1
NetC140_1: C140.1 R14.2 U25.32(XTAL2/CLKIN_EN) X4.3
NetC153_1: C153.1 L14.2 P2.1(PWR)
NetD3_1: D3.1(GRN+) R46.2
NetD7_1: D7.1(GRN+) R47.2
NetD8_1: D8.1(GRN+) R48.2
NetD11_1: D11.1(RED+) R6.2
NetD17_1: D17.1(WHT+) R56.2
NetL9_1: L9.1 U21.1(OUT)
NetL13_1: L13.1 U3.1(OUT)
NetL14_1: L14.1 U26.1(OUT)
NetP1_7: P1.7(RX_CT) R49.1
NetP1_8: P1.8(TX_CT) R35.1
NetP1_9: P1.9(RJ_7/8) R27.1
NetP1_10: P1.10(RJ_4/5) R13.1
NetP1_11: P1.11(G_LED-) R18.1
NetP1_13: P1.13(Y_LED-) R19.2
NetR55_2: R55.2 U25.35(RBIAS)
NetRN17_5: RN17.5(B) U25.28(LCLPWR/NREM0/SUSP)
NetRN17_6: RN17.6(B) U25.25(HS_IND/CFG1)
NetRN17_7: RN17.7(B) U25.24(SCL/CFG0)
NetRN17_8: RN17.8(B) U25.22(SDA/NREM1)

Not connected (* = marked no-connect by the designer): U25 12(PRTPWR1) 16(PRTPWR2) 18(PRTPWR3) 20(PRTPWR4)

### Layout directives
differential pair: U3_N_7, U3_P_7, U4_N_7, U4_P_7, U5_N_7, U5_P_7, UH2_N, UH2_P, UH3_N_7, UH3_P_7, UH4_N_7, UH4_P_7, UH5_N_7, UH5_P_7, USB0_N, USB0_P

### Notes on the sheet
- POWER
- STORAGE
- OUTERNET INC. - LANTERN PROJECT
- Title:
- Size:
- Date:
- B
- Engineer:
- Time:
- Rev:
- Sheet
- of
- File:
- (in symbol 220UF_16V_POLY_8X8) +

### Library data of the parts
C29 = 1000PF_2KV, 1206: CAP - 1206 PKG
C39 C40 C52 C53 C129 C146 C148 C151 C152 = 0.1UF_16V, 0402: CAP - 0402 PKG
C44 = 1UF_10V, 0402: CAP - 0402 PKG
C46 C58 C153 = 220UF_16V_POLY_8X8: CAP - ELEC_POLY, 8mm x 8mm x 3.5mm
C56 C61 C62 = 10UF_10V, 0805: CAP - 0805 PKG
C130 C140 = 22PF_50V, 0402: CAP - 0402 PKG
C145 C147 C149 C150 = 2.2UF_6V, 0402: CAP - 0402 PKG
D2 D10 = SEMTECH_RCLAMP0524PA: DIODE - TVS ARRAY, 0.3PF
D3 D7 D8 = LED_1X3_SIDE-GREEN: LED - SIDEVIEW, SMT, GREEN
D11 = LED_1X3_SIDE-RED: LED - SIDEVIEW, SMT, RED
D17 = LED_1X3_SIDE-WHITE: LED - SIDEVIEW, SMT, WHITE
L8 L19 L20 = MURATA_DLP11TB800UL2: FERRITE - COMMON MODE FILTER, USB3, FILM
L9 L13 L14 = FERRITE_600, 0805: FERRITE BEAD - 600 OHM, 2A, 0805 PKG
P1 = HANRUN_HR851150H: CONN - RJ45 10/100 W/POE, SPEEDTECH
P2 = USB-A-SMT: CONN - USB TYPE A SMT
P4 = USB-A-DUAL: CONN - USB TYPE A - DUAL
R6 R46-R48 R56 = 1K, 0402: RES - 0402 PKG
R13 R27 R35 R49 = 75, 0402: RES - 0402 PKG
R14 = 1M, 0402: RES - 0402 PKG
R18 R19 = 330, 0402: RES - 0402 PKG
R51 = 100K, 0402: RES - 0402 PKG
R55 = 12.0K_1%, 0402: RES - 0402 PKG
RN12 RN13 RN17 RN18 = 10KNI, EXB-28V: RES NET, 4 INDIVIDUAL, EXB-28V
SD1 = MOLEX_104031-0811: CONN - SD/MMC, MICRO, PUSH/PUSH, W/CD
U3 U21 U26 = AP2141, SOT-23-5: IC - POWER SWITCH, 500MA, LOW TRUE
U25 = USB2514BI-AEZG, QFN36: USB - 2.0 HUB, FOUR PORT, I-TEMP
X4 = 24MHZ, X3225: CRYSTAL - SMT, 3.2MM x 2.5MM, ABM8 PKG